# EAGLE design aux-io (EAGLE 9.2.2)

## Sheet 1 of 5
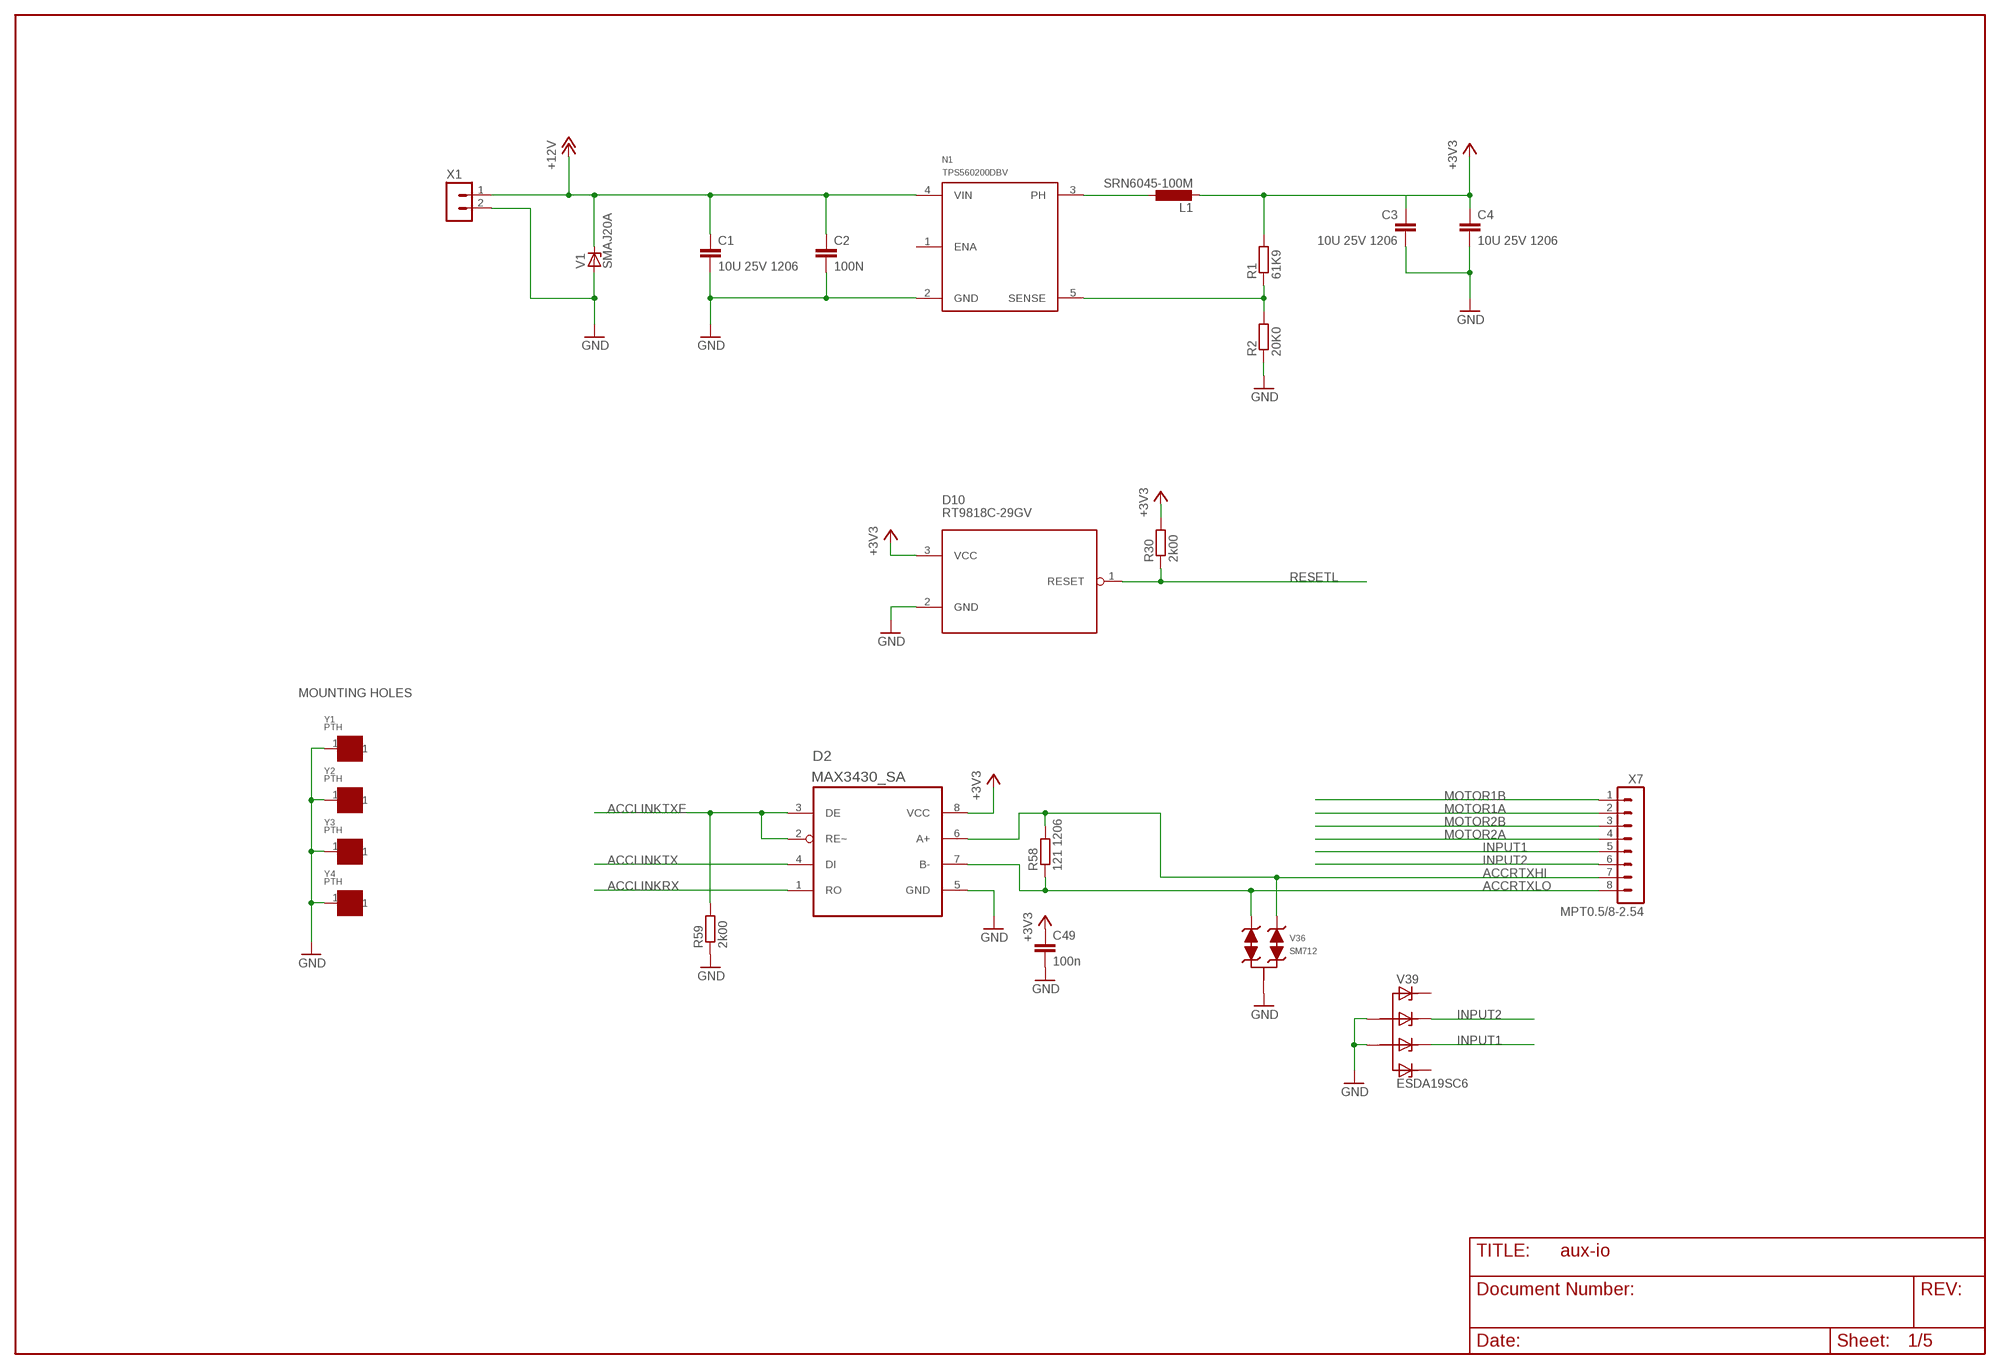
[diagram p0: schematic, sheet 1]

### Parts
C1  10U 25V 1206  CAP1206  [C1206]
C2  100N  CAP0603  [C0603]
C3  10U 25V 1206  CAP1206  [C1206]
C4  10U 25V 1206  CAP1206  [C1206]
C49  100n  CAP0603  [C0603]
D2  MAX3430_SA  MAX3088_SA  [SOIC8-N_MC]
D10  RT9818C-29GV  [SOT23]
L1  SRN6045-100M  [SRN6045]
N1  TPS560200DBV  [SOT95P280X145-5N]
R1  61K9  RES0603  [R0603]
R2  20K0  RES0603  [R0603]
R30  2k00  RES0603  [R0603]
R58  121 1206  RES1206  [R1206]
R59  2k00  RES0603  [R0603]
V1  SMAJ20A  SMAJXXA  [DO214AC]
V36  SM712  [SOT23]
V39  ESDA19SC6  ESDAXXSC6  [SOT23-6]
X1  TE_RUUVILIITIN2  [TE_RUUVILIITIN2]
X7  MPT0.5/8-2.54  [MPT0.5/8-2.54]
Y1  PTH  [PTH-3.2-6DIA]
Y2  PTH  [PTH-3.2-6DIA]
Y3  PTH  [PTH-3.2-6DIA]
Y4  PTH  [PTH-3.2-6DIA]

### Nets
+3V3: C3.1 C4.1 C49.1 D2.8(VCC) D10.3(VCC) L1.2 R1.2 R30.2 ; also sheet 4,5
+12V: C1.1 C2.1 N1.4(VIN) V1.C X1.1 ; also sheet 2,3
ACCLINKRX: D2.1(RO) ; also sheet 5
ACCLINKTX: D2.4(DI) ; also sheet 5
ACCLINKTXE: D2.2(RE~) D2.3(DE) R59.2 ; also sheet 5
ACCRTXHI: D2.6(A+) R58.2 V36.1 X7.7
ACCRTXLO: D2.7(B-) R58.1 V36.2 X7.8
GND: C1.2 C2.2 C3.2 C4.2 C49.2 D2.5(GND) D10.2(GND) N1.2(GND) R2.1 R59.1 V1.A V36.3 V39.2(A) V39.5(A1) X1.2 Y1.1 Y2.1 Y3.1 Y4.1 ; also sheet 2,3,4,5
INPUT1: V39.4(C2) X7.5 ; also sheet 5
INPUT2: V39.3(C1) X7.6 ; also sheet 5
MOTOR1A: X7.2 ; also sheet 3
MOTOR1B: X7.1 ; also sheet 3
MOTOR2A: X7.4 ; also sheet 3
MOTOR2B: X7.3 ; also sheet 3
N$1: L1.1 N1.3(PH)
N$3: N1.5(SENSE) R1.1 R2.2
RESETL: D10.1(RESET) R30.1 ; also sheet 4
Unconnected: N1.1(ENA) V39.1(C) V39.6(C3)

### Notes on the sheet
- MOUNTING HOLES

## Sheet 2 of 5
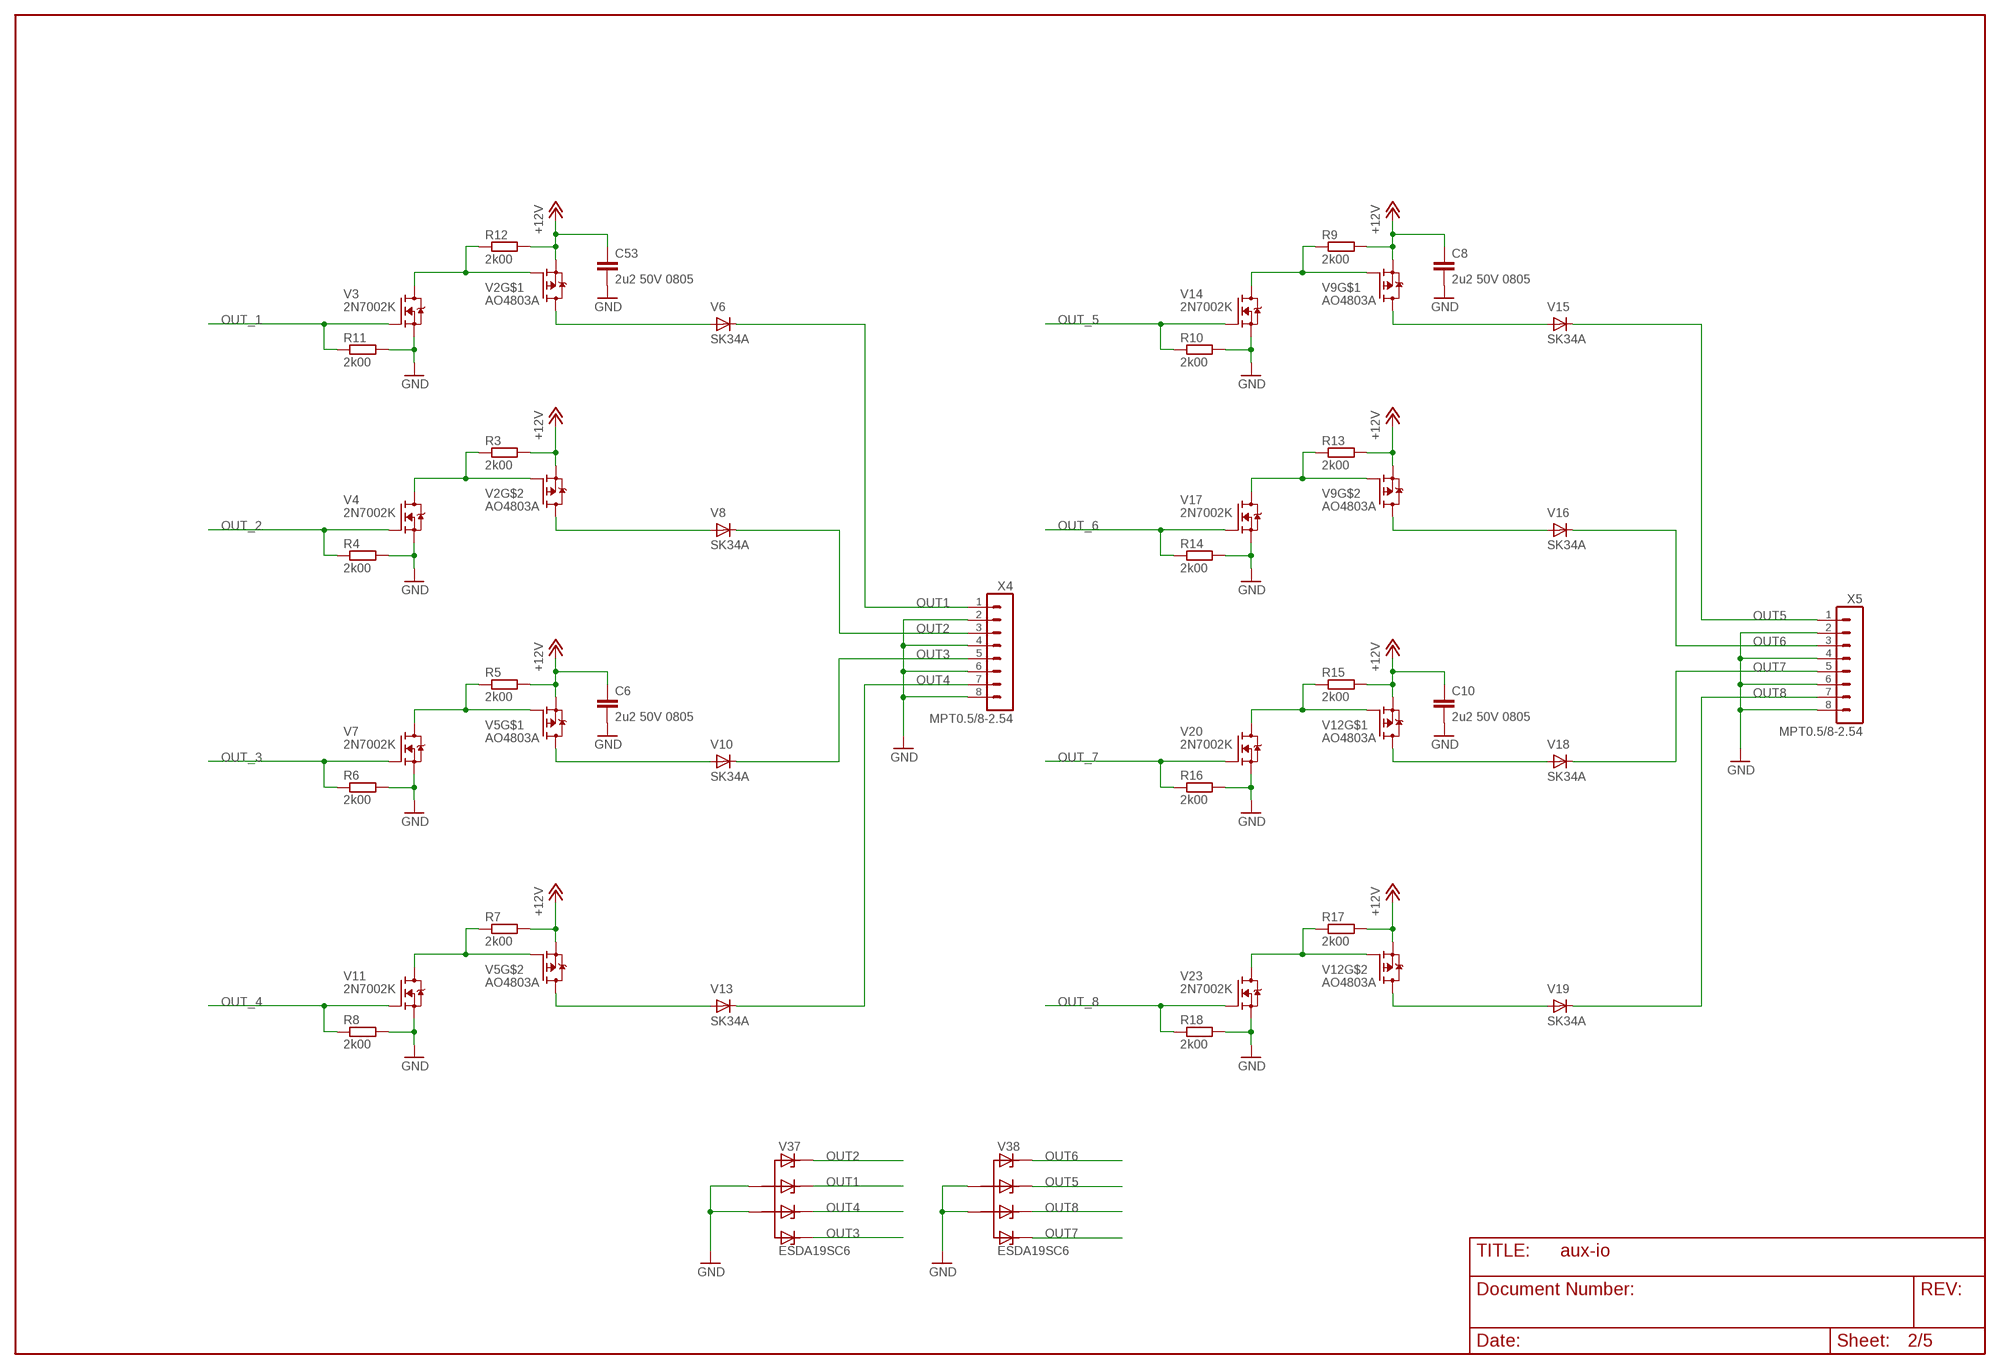
[diagram p1: schematic, sheet 2]

### Parts
C6  2u2 50V 0805  CAP0805  [C0805]
C8  2u2 50V 0805  CAP0805  [C0805]
C10  2u2 50V 0805  CAP0805  [C0805]
C53  2u2 50V 0805  CAP0805  [C0805]
R3  2k00  RES0603  [R0603]
R4  2k00  RES0603  [R0603]
R5  2k00  RES0603  [R0603]
R6  2k00  RES0603  [R0603]
R7  2k00  RES0603  [R0603]
R8  2k00  RES0603  [R0603]
R9  2k00  RES0603  [R0603]
R10  2k00  RES0603  [R0603]
R11  2k00  RES0603  [R0603]
R12  2k00  RES0603  [R0603]
R13  2k00  RES0603  [R0603]
R14  2k00  RES0603  [R0603]
R15  2k00  RES0603  [R0603]
R16  2k00  RES0603  [R0603]
R17  2k00  RES0603  [R0603]
R18  2k00  RES0603  [R0603]
V2  AO4803A  [SOIC8-N_MC]
V3  2N7002K  [SOT23]
V4  2N7002K  [SOT23]
V5  AO4803A  [SOIC8-N_MC]
V6  SK34A  [DO214AC]
V7  2N7002K  [SOT23]
V8  SK34A  [DO214AC]
V9  AO4803A  [SOIC8-N_MC]
V10  SK34A  [DO214AC]
V11  2N7002K  [SOT23]
V12  AO4803A  [SOIC8-N_MC]
V13  SK34A  [DO214AC]
V14  2N7002K  [SOT23]
V15  SK34A  [DO214AC]
V16  SK34A  [DO214AC]
V17  2N7002K  [SOT23]
V18  SK34A  [DO214AC]
V19  SK34A  [DO214AC]
V20  2N7002K  [SOT23]
V23  2N7002K  [SOT23]
V37  ESDA19SC6  ESDAXXSC6  [SOT23-6]
V38  ESDA19SC6  ESDAXXSC6  [SOT23-6]
X4  MPT0.5/8-2.54  [MPT0.5/8-2.54]
X5  MPT0.5/8-2.54  [MPT0.5/8-2.54]

### Nets
+12V: C6.1 C8.1 C10.1 C53.1 R3.2 R5.2 R7.2 R9.2 R12.2 R13.2 R15.2 R17.2 V2.1(S) V2.3(S) V5.1(S) V5.3(S) V9.1(S) V9.3(S) V12.1(S) V12.3(S) ; also sheet 1,3
GND: C6.2 C8.2 C10.2 C53.2 R4.2 R6.2 R8.2 R10.2 R11.2 R14.2 R16.2 R18.2 V3.2(S) V4.2(S) V7.2(S) V11.2(S) V14.2(S) V17.2(S) V20.2(S) V23.2(S) V37.2(A) V37.5(A1) V38.2(A) V38.5(A1) X4.2 X4.4 X4.6 X4.8 X5.2 X5.4 X5.6 X5.8 ; also sheet 1,3,4,5
N$2: R3.1 V2.2(G) V4.3(D)
N$4: R5.1 V5.4(G) V7.3(D)
N$5: R7.1 V5.2(G) V11.3(D)
N$6: R9.1 V9.4(G) V14.3(D)
N$7: R13.1 V9.2(G) V17.3(D)
N$8: R15.1 V12.4(G) V20.3(D)
N$9: R17.1 V12.2(G) V23.3(D)
N$11: R12.1 V2.4(G) V3.3(D)
NERT: V2.5(D) V2.6(D) V6.A
NERT1: V2.7(D) V2.8(D) V8.A
NERT2: V5.5(D) V5.6(D) V10.A
NERT3: V5.7(D) V5.8(D) V13.A
NERT4: V9.5(D) V9.6(D) V15.A
NERT5: V9.7(D) V9.8(D) V16.A
NERT6: V12.5(D) V12.6(D) V18.A
NERT7: V12.7(D) V12.8(D) V19.A
OUT1: V6.C V37.3(C1) X4.1
OUT2: V8.C V37.1(C) X4.3
OUT3: V10.C V37.6(C3) X4.5
OUT4: V13.C V37.4(C2) X4.7
OUT5: V15.C V38.3(C1) X5.1
OUT6: V16.C V38.1(C) X5.3
OUT7: V18.C V38.6(C3) X5.5
OUT8: V19.C V38.4(C2) X5.7
OUT_1: R11.1 V3.1(G) ; also sheet 5
OUT_2: R4.1 V4.1(G) ; also sheet 5
OUT_3: R6.1 V7.1(G) ; also sheet 5
OUT_4: R8.1 V11.1(G) ; also sheet 5
OUT_5: R10.1 V14.1(G) ; also sheet 5
OUT_6: R14.1 V17.1(G) ; also sheet 5
OUT_7: R16.1 V20.1(G) ; also sheet 5
OUT_8: R18.1 V23.1(G) ; also sheet 5

## Sheet 3 of 5
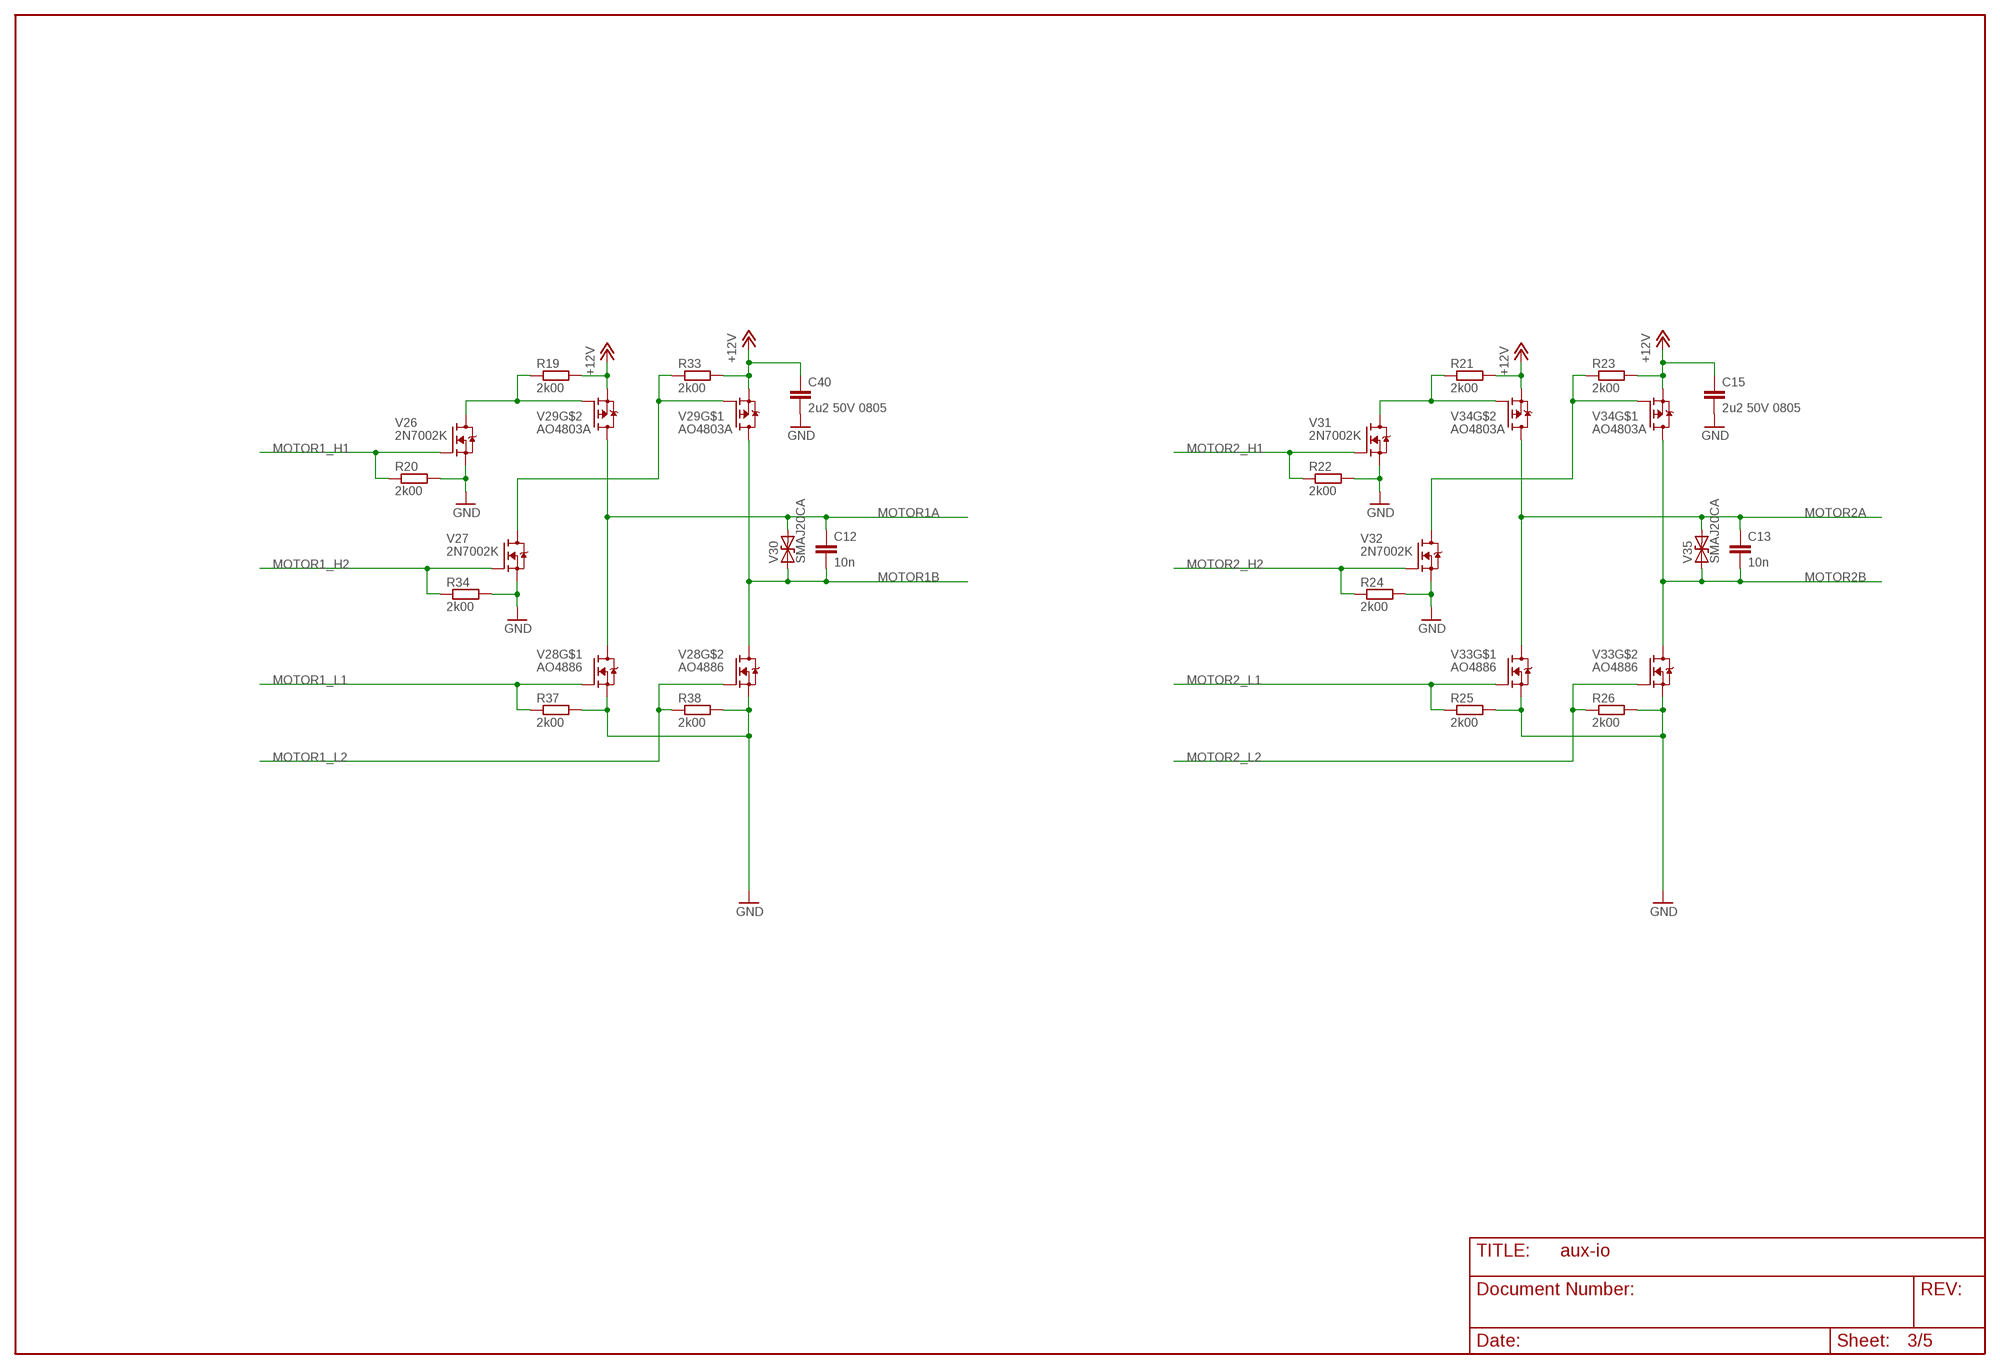
[diagram p2: schematic, sheet 3]

### Parts
C12  10n  CAP0603  [C0603]
C13  10n  CAP0603  [C0603]
C15  2u2 50V 0805  CAP0805  [C0805]
C40  2u2 50V 0805  CAP0805  [C0805]
R19  2k00  RES0603  [R0603]
R20  2k00  RES0603  [R0603]
R21  2k00  RES0603  [R0603]
R22  2k00  RES0603  [R0603]
R23  2k00  RES0603  [R0603]
R24  2k00  RES0603  [R0603]
R25  2k00  RES0603  [R0603]
R26  2k00  RES0603  [R0603]
R33  2k00  RES0603  [R0603]
R34  2k00  RES0603  [R0603]
R37  2k00  RES0603  [R0603]
R38  2k00  RES0603  [R0603]
V26  2N7002K  [SOT23]
V27  2N7002K  [SOT23]
V28  AO4886  [SOIC8-N_MC]
V29  AO4803A  [SOIC8-N_MC]
V30  SMAJ20CA  SMAJXXCA  [DO214AC]
V31  2N7002K  [SOT23]
V32  2N7002K  [SOT23]
V33  AO4886  [SOIC8-N_MC]
V34  AO4803A  [SOIC8-N_MC]
V35  SMAJ20CA  SMAJXXCA  [DO214AC]

### Nets
+12V: C15.1 C40.1 R19.2 R21.2 R23.2 R33.2 V29.1(S) V29.3(S) V34.1(S) V34.3(S) ; also sheet 1,2
GND: C15.2 C40.2 R20.2 R22.2 R24.2 R25.2 R26.2 R34.2 R37.2 R38.2 V26.2(S) V27.2(S) V28.1(S) V28.3(S) V31.2(S) V32.2(S) V33.1(S) V33.3(S) ; also sheet 1,2,4,5
MOTOR1_H1: R20.1 V26.1(G) ; also sheet 5
MOTOR1_H2: R34.1 V27.1(G) ; also sheet 5
MOTOR1_L1: R37.1 V28.4(G) ; also sheet 5
MOTOR1_L2: R38.1 V28.2(G) ; also sheet 5
MOTOR1A: C12.1 V28.5(D) V28.6(D) V29.7(D) V29.8(D) V30.A ; also sheet 1
MOTOR1B: C12.2 V28.7(D) V28.8(D) V29.5(D) V29.6(D) V30.C ; also sheet 1
MOTOR2_H1: R22.1 V31.1(G) ; also sheet 5
MOTOR2_H2: R24.1 V32.1(G) ; also sheet 5
MOTOR2_L1: R25.1 V33.4(G) ; also sheet 5
MOTOR2_L2: R26.1 V33.2(G) ; also sheet 5
MOTOR2A: C13.1 V33.5(D) V33.6(D) V34.7(D) V34.8(D) V35.A ; also sheet 1
MOTOR2B: C13.2 V33.7(D) V33.8(D) V34.5(D) V34.6(D) V35.C ; also sheet 1
N$10: R19.1 V26.3(D) V29.2(G)
N$12: R33.1 V27.3(D) V29.4(G)
N$15: R21.1 V31.3(D) V34.2(G)
N$16: R23.1 V32.3(D) V34.4(G)

## Sheet 4 of 5
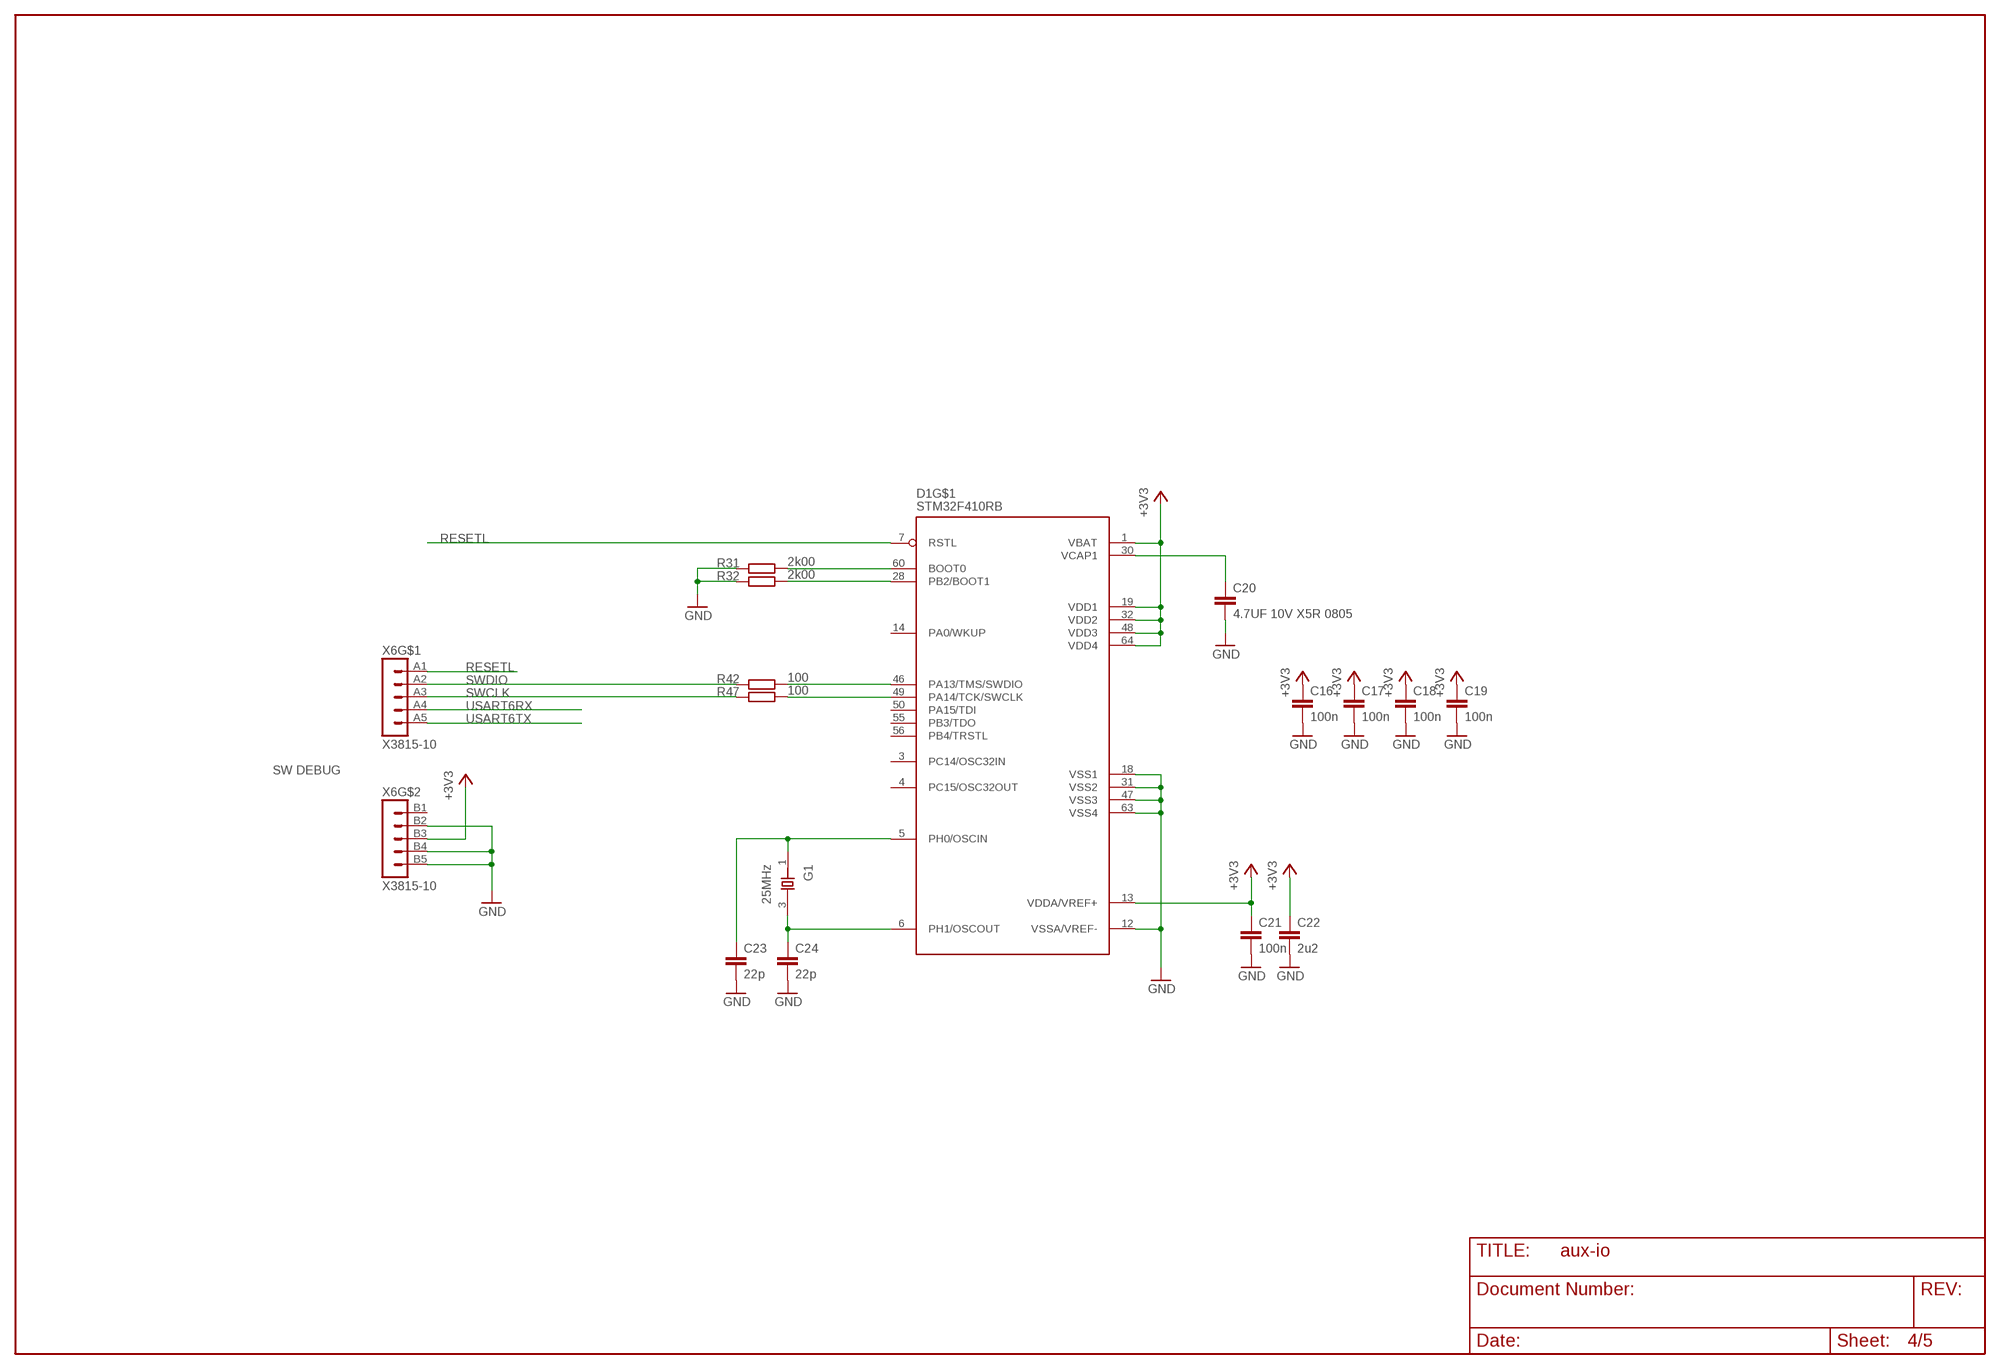
[diagram p3: schematic, sheet 4]

### Parts
C16  100n  CAP0603  [C0603]
C17  100n  CAP0603  [C0603]
C18  100n  CAP0603  [C0603]
C19  100n  CAP0603  [C0603]
C20  4.7UF 10V X5R 0805  CAP0805  [C0805]
C21  100n  CAP0603  [C0603]
C22  2u2  CAP0603  [C0603]
C23  22p  CAP0603  [C0603]
C24  22p  CAP0603  [C0603]
D1  STM32F410RB  [LQFP-64]
G1  25MHz  XTAL_3225_SMD  [X_3225]
R31  2k00  RES0603  [R0603]
R32  2k00  RES0603  [R0603]
R42  100  RES0603  [R0603]
R47  100  RES0603  [R0603]
X6  X3815-10  [15110102601]

### Nets
+3V3: C16.1 C17.1 C18.1 C19.1 C21.1 C22.1 D1.1(VBAT) D1.13(VDDA/VREF+) D1.19(VDD1) D1.32(VDD2) D1.48(VDD3) D1.64(VDD4) X6.B3 ; also sheet 1,5
BOOT0: D1.60(BOOT0) R31.2
BOOT1: D1.28(PB2/BOOT1) R32.2
GND: C16.2 C17.2 C18.2 C19.2 C20.2 C21.2 C22.2 C23.2 C24.2 D1.12(VSSA/VREF-) D1.18(VSS1) D1.31(VSS2) D1.47(VSS3) D1.63(VSS4) R31.1 R32.1 X6.B2 X6.B4 X6.B5 ; also sheet 1,2,3,5
OSCIN: C23.1 D1.5(PH0/OSCIN) G1.1(X1)
OSCOUT: C24.1 D1.6(PH1/OSCOUT) G1.3(X2)
RESETL: D1.7(RSTL) X6.A1 ; also sheet 1
SWCLK: R47.1 X6.A3
SWCLK_CPU: D1.49(PA14/TCK/SWCLK) R47.2
SWDIO: R42.1 X6.A2
SWDIO_CPU: D1.46(PA13/TMS/SWDIO) R42.2
USART6RX: X6.A4 ; also sheet 5
USART6TX: X6.A5 ; also sheet 5
VCAP1: C20.1 D1.30(VCAP1)
Unconnected: D1.3(PC14/OSC32IN) D1.4(PC15/OSC32OUT) D1.14(PA0/WKUP) D1.50(PA15/TDI) D1.55(PB3/TDO) D1.56(PB4/TRSTL) X6.B1

### Notes on the sheet
- SW DEBUG

## Sheet 5 of 5
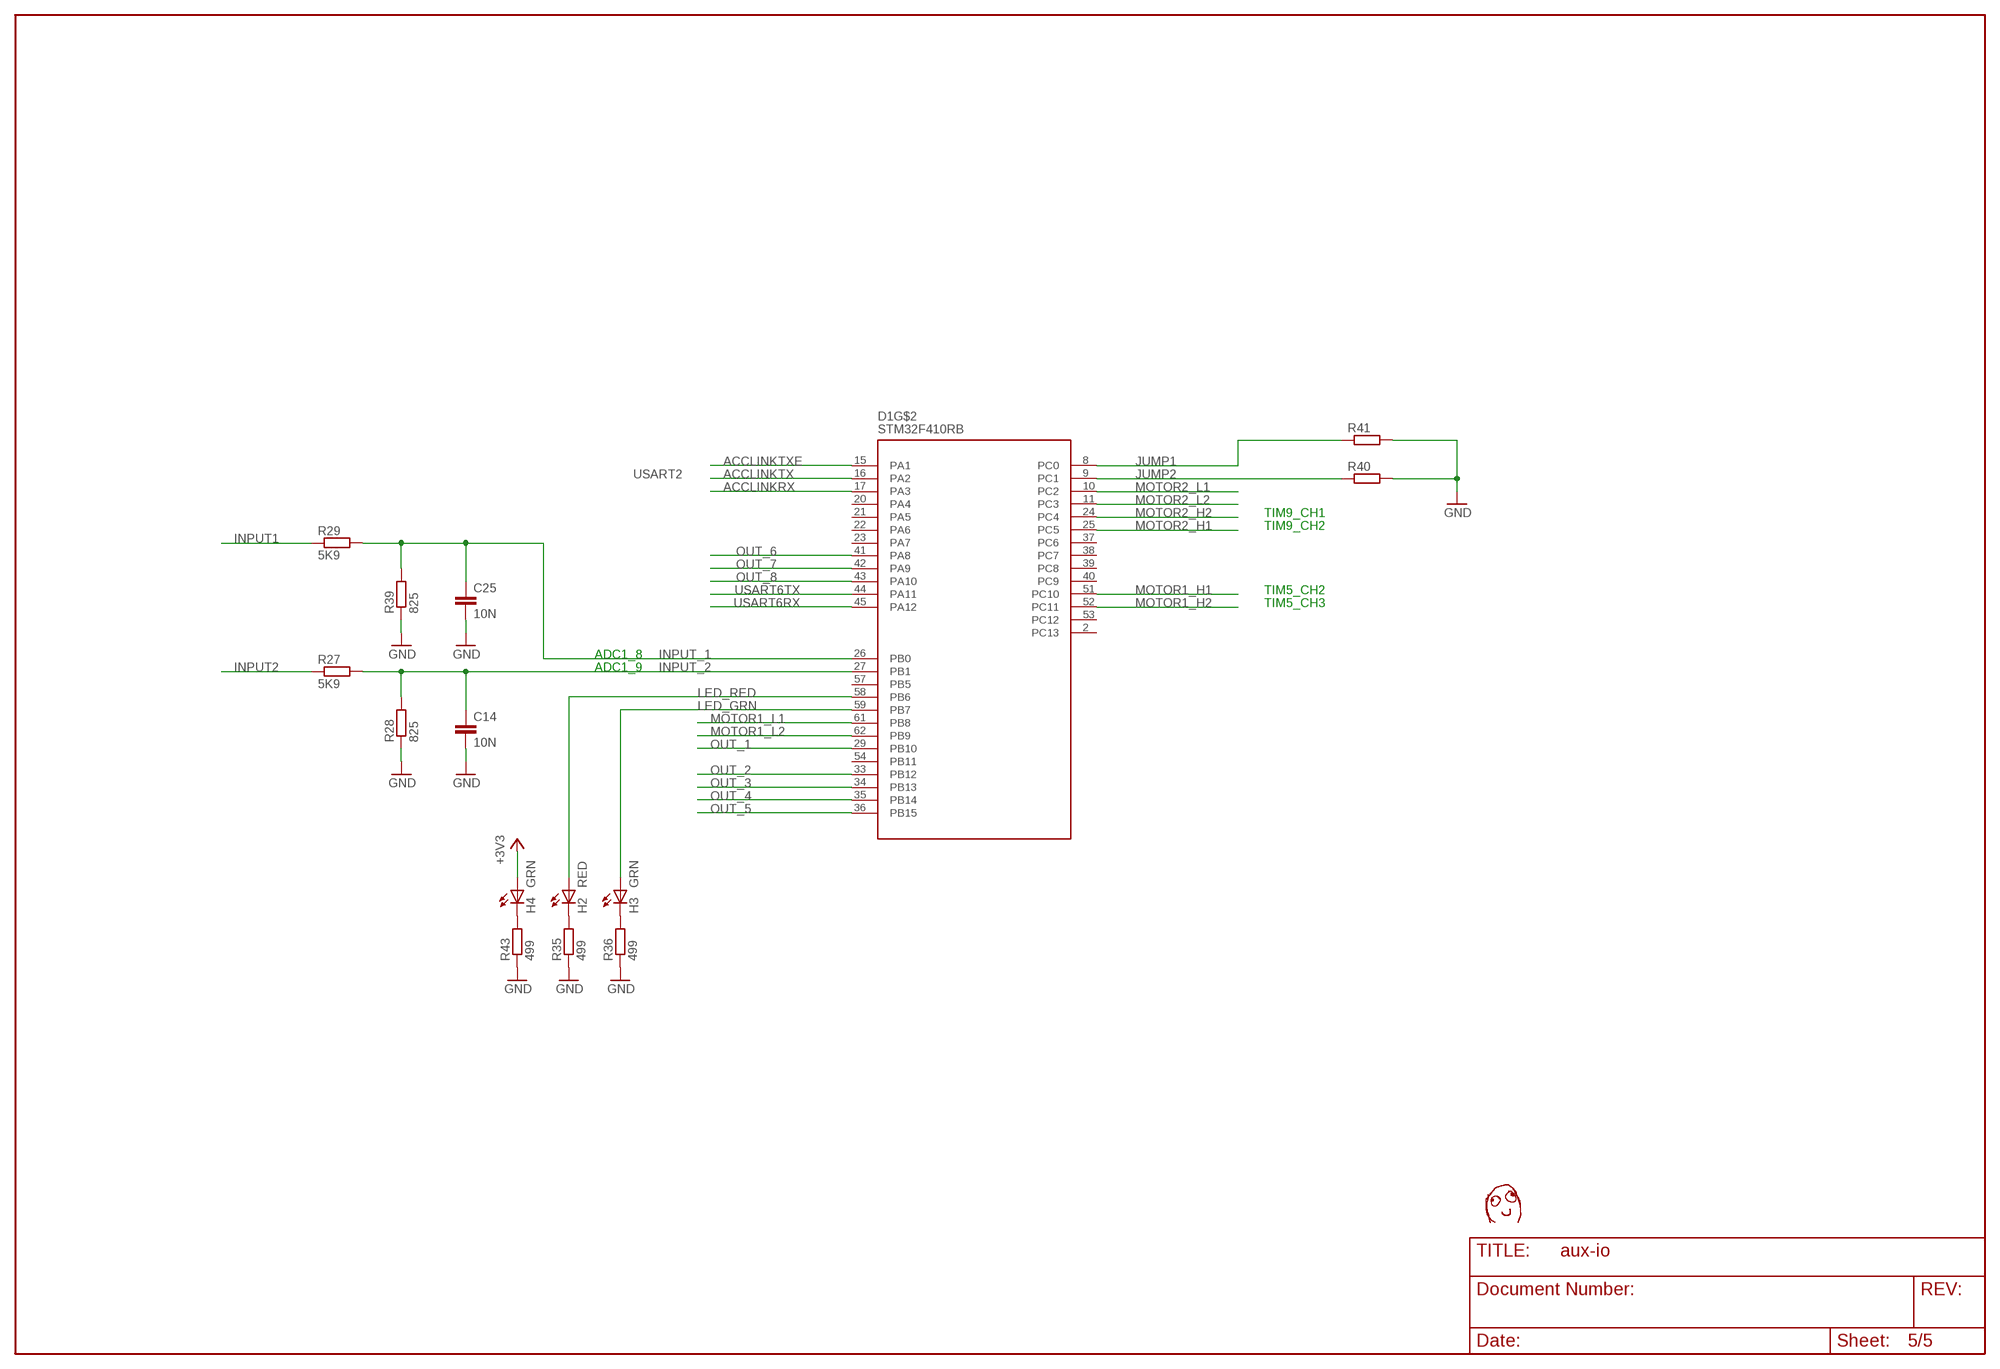
[diagram p4: schematic, sheet 5]

### Parts
C14  10N  CAP0603  [C0603]
C25  10N  CAP0603  [C0603]
H2  RED  LEDCHIP-LED0603  [CHIP-LED0603]
H3  GRN  LEDCHIP-LED0603  [CHIP-LED0603]
H4  GRN  LEDCHIP-LED0603  [CHIP-LED0603]
R27  5K9  RES1206  [R1206]
R28  825  RES0603  [R0603]
R29  5K9  RES1206  [R1206]
R35  499  RES0603  [R0603]
R36  499  RES0603  [R0603]
R39  825  RES0603  [R0603]
R40  RES0603  [R0603]
R41  RES0603  [R0603]
R43  499  RES0603  [R0603]
U$1  DAFUG  [DAFUG]

### Nets
+3V3: H4.A ; also sheet 1,4
ACCLINKRX: D1.17(PA3) ; also sheet 1
ACCLINKTX: D1.16(PA2) ; also sheet 1
ACCLINKTXE: D1.15(PA1) ; also sheet 1
GND: C14.2 C25.2 R28.1 R35.1 R36.1 R39.1 R40.2 R41.2 R43.1 ; also sheet 1,2,3,4
INPUT1: R29.1 ; also sheet 1
INPUT2: R27.1 ; also sheet 1
INPUT_1: C25.1 D1.26(PB0) R29.2 R39.2
INPUT_2: C14.1 D1.27(PB1) R27.2 R28.2
JUMP1: D1.8(PC0) R41.1
JUMP2: D1.9(PC1) R40.1
LED_GRN: D1.59(PB7) H3.A
LED_RED: D1.58(PB6) H2.A
MOTOR1_H1: D1.51(PC10) ; also sheet 3
MOTOR1_H2: D1.52(PC11) ; also sheet 3
MOTOR1_L1: D1.61(PB8) ; also sheet 3
MOTOR1_L2: D1.62(PB9) ; also sheet 3
MOTOR2_H1: D1.25(PC5) ; also sheet 3
MOTOR2_H2: D1.24(PC4) ; also sheet 3
MOTOR2_L1: D1.10(PC2) ; also sheet 3
MOTOR2_L2: D1.11(PC3) ; also sheet 3
N$19: H3.C R36.2
N$20: H2.C R35.2
N$21: H4.C R43.2
OUT_1: D1.29(PB10) ; also sheet 2
OUT_2: D1.33(PB12) ; also sheet 2
OUT_3: D1.34(PB13) ; also sheet 2
OUT_4: D1.35(PB14) ; also sheet 2
OUT_5: D1.36(PB15) ; also sheet 2
OUT_6: D1.41(PA8) ; also sheet 2
OUT_7: D1.42(PA9) ; also sheet 2
OUT_8: D1.43(PA10) ; also sheet 2
USART6RX: D1.45(PA12) ; also sheet 4
USART6TX: D1.44(PA11) ; also sheet 4
Unconnected: D1.2(PC13) D1.20(PA4) D1.21(PA5) D1.22(PA6) D1.23(PA7) D1.37(PC6) D1.38(PC7) D1.39(PC8) D1.40(PC9) D1.53(PC12) D1.54(PB11) D1.57(PB5)

### Notes on the sheet
- USART2
- TIM9_CH1
- TIM9_CH2
- TIM5_CH2
- TIM5_CH3
- ADC1_8
- ADC1_9

## Library data of the parts
C1-C4 C14 C25 = passiivit:CAP
C6 C8 C10 C12 C13 C15-C24 C40 C49 C53 = omat_ic_2:CAP
D1 = piirit:STM32F410RB
D2 = omat_ic_2:MAX3088_SA
D10 = omat_ic_2:RT9818C-29GV
G1 = omat_ic_2:XTAL_3225_SMD: CRYSTAL CLOCK OSCILLATORS 5.0 Vdc or 3.3 Vdc - LOW PROFILE ULTRA MINIATURE CERAMIC SURFACE MOUNT Source: http://www.abracon.com/Oscillators/asf1-L-L1.pdf
H2-H4 = omat_ic_2:LED: LED OSRAM: - CHIPLED LG R971, LG N971, LY N971, LG Q971, LY Q971, LO R971, LY R971 LH N974, LH R974 LS Q976, LO Q976, LY Q976 LO Q996 - Hyper CHIPLED LW Q18S LB Q993, LB Q99A, LB R99A - SideLED LS A670, LO A670, LY A670, LG A670, LP A670 LB A673, LV A673, LT A673, LW A673 LH A674 LY A675 LS A676, LA A676, LO A676, LY A676, LW A676 LS A679, LY A679, LG A679 - Hyper Micro SIDELED® LS Y876, LA Y876, LO Y876, LY Y876 LT Y87S - SmartLED LW L88C, LW L88S LB L89C, LB L89S, LG L890 LS L89K, LO L89K, LY L89K LS L896, LA L896, LO L896, LY L896 - TOPLED LS T670, LO T670, LY T670, LG T670, LP T670 LSG T670, LSP T670, LSY T670, LOP T670, LYG T670 LG T671, LOG T671, LSG T671 LB T673, LV T673, LT T673, LW T673 LH T674 LS T676, LA T676, LO T676, LY T676, LB T676, LH T676, LSB T676, LW T676 LB T67C, LV T67C, LT T67C, LS T67K, LO T67K, LY T67K, LW E67C LS E67B, LA E67B, LO E67B, LY E67B, LB E67C, LV E67C, LT E67C LW T67C LS T679, LY T679, LG T679 LS T770, LO T770, LY T770, LG T770, LP T770 LB T773, LV T773, LT T773, LW T773 LH T774 LS E675, LA E675, LY E675, LS T675 LS T776, LA T776, LO T776, LY T776, LB T776 LHGB T686 LT T68C, LB T68C - Hyper Mini TOPLED® LB M676 - Mini TOPLED Santana® LG M470 LS M47K, LO M47K, LY M47K Source: http://www.osram.convergy.de LUXEON: - LUMILED® LXK2-PW12-R00, LXK2-PW12-S00, LXK2-PW14-U00, LXK2-PW14-V00 LXK2-PM12-R00, LXK2-PM12-S00, LXK2-PM14-U00 LXK2-PE12-Q00, LXK2-PE12-R00, LXK2-PE12-S00, LXK2-PE14-T00, LXK2-PE14-U00 LXK2-PB12-K00, LXK2-PB12-L00, LXK2-PB12-M00, LXK2-PB14-N00, LXK2-PB14-P00, LXK2-PB14-Q00 LXK2-PR12-L00, LXK2-PR12-M00, LXK2-PR14-Q00, LXK2-PR14-R00 LXK2-PD12-Q00, LXK2-PD12-R00, LXK2-PD12-S00 LXK2-PH12-R00, LXK2-PH12-S00 LXK2-PL12-P00, LXK2-PL12-Q00, LXK2-PL12-R00 Source: www.luxeon.com KINGBRIGHT: KA-3528ASYC Source: www.kingbright.com
L1 = passiivit:SRN6045
N1 = piirit:TPS560200DBV
R1 R2 R27-R29 R39-R41 = passiivit:RES
R3-R26 R30-R38 R42 R43 R47 R58 R59 = omat_ic_2:RES
U$1 = omat:DAFUG
V1 = diskreetit:SMAJXXA
V2 V5 V9 V12 = diskreetit:AO4803A
V3 V4 V7 V11 V14 V17 V20 V23 V26 V27 V31 V32 = omat_ic_2:2N7002K
V6 V8 V10 V13 V15 V16 V18 V19 = diskreetit:SK34A
V28 V33 = omat_ic_2:AO4886
V29 V34 = omat_ic_2:AO4803A
V30 V35 = omat_ic_2:SMAJXXCA
V36 = omat_ic_2:SM712
V37-V39 = diskreetit:ESDAXXSC6
X1 = liittimet:TE_RUUVILIITIN2
X4 X5 X7 = liittimet:MPT0.5/8-2.54
X6 = liittimet:X3815-10
Y1-Y4 = omat:PTH

## Net classes
2 other: width 0.3 mm, drill 0.3 mm, clearance 1 mm to class 1
3 supply: width 0.3 mm, drill 0.3 mm
4 power: width 0.5 mm, drill 0.5 mm

## Board
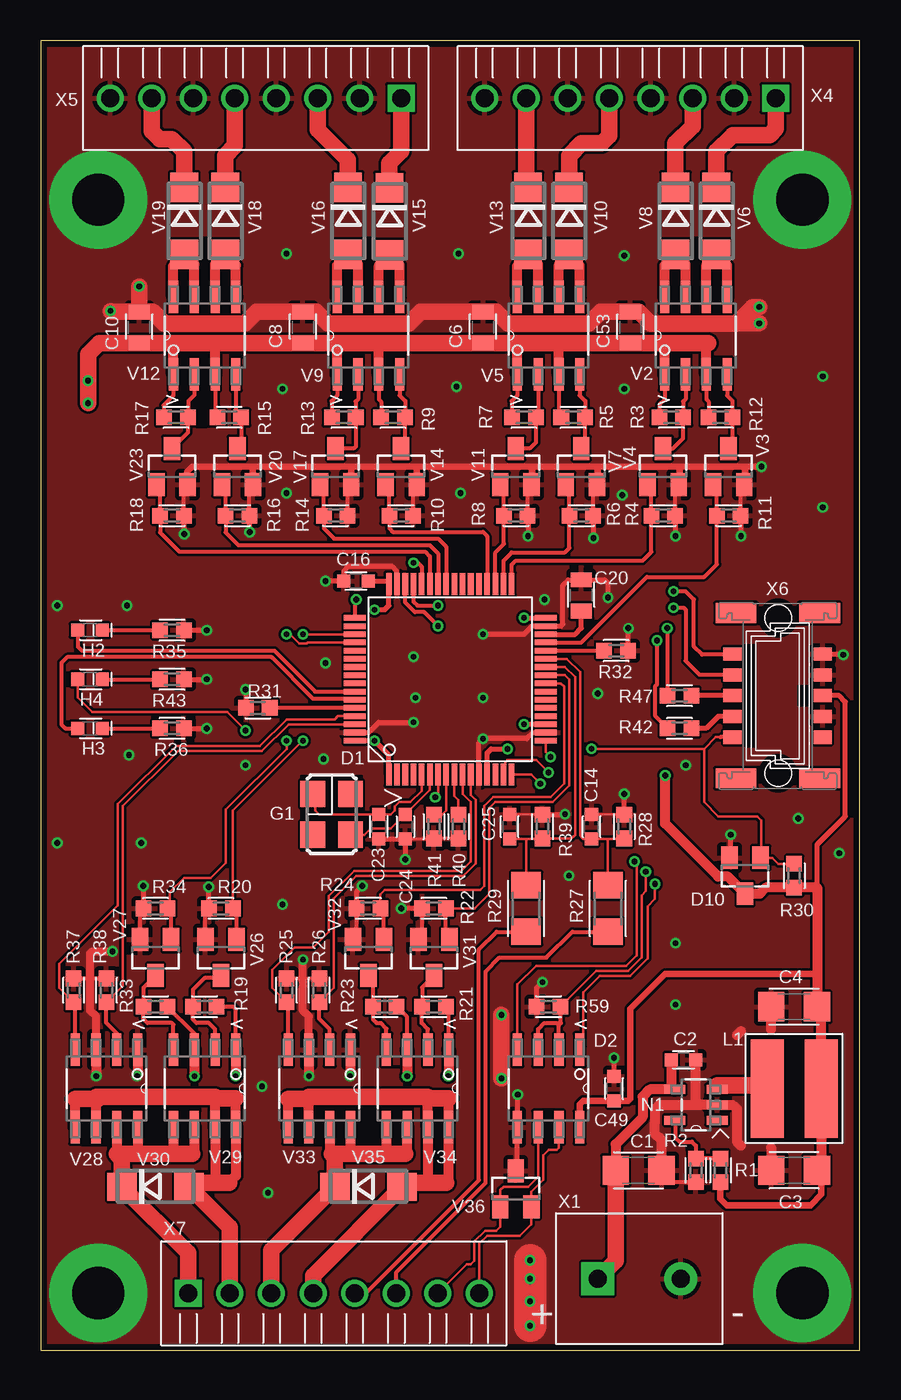
[diagram p5: board, top side]
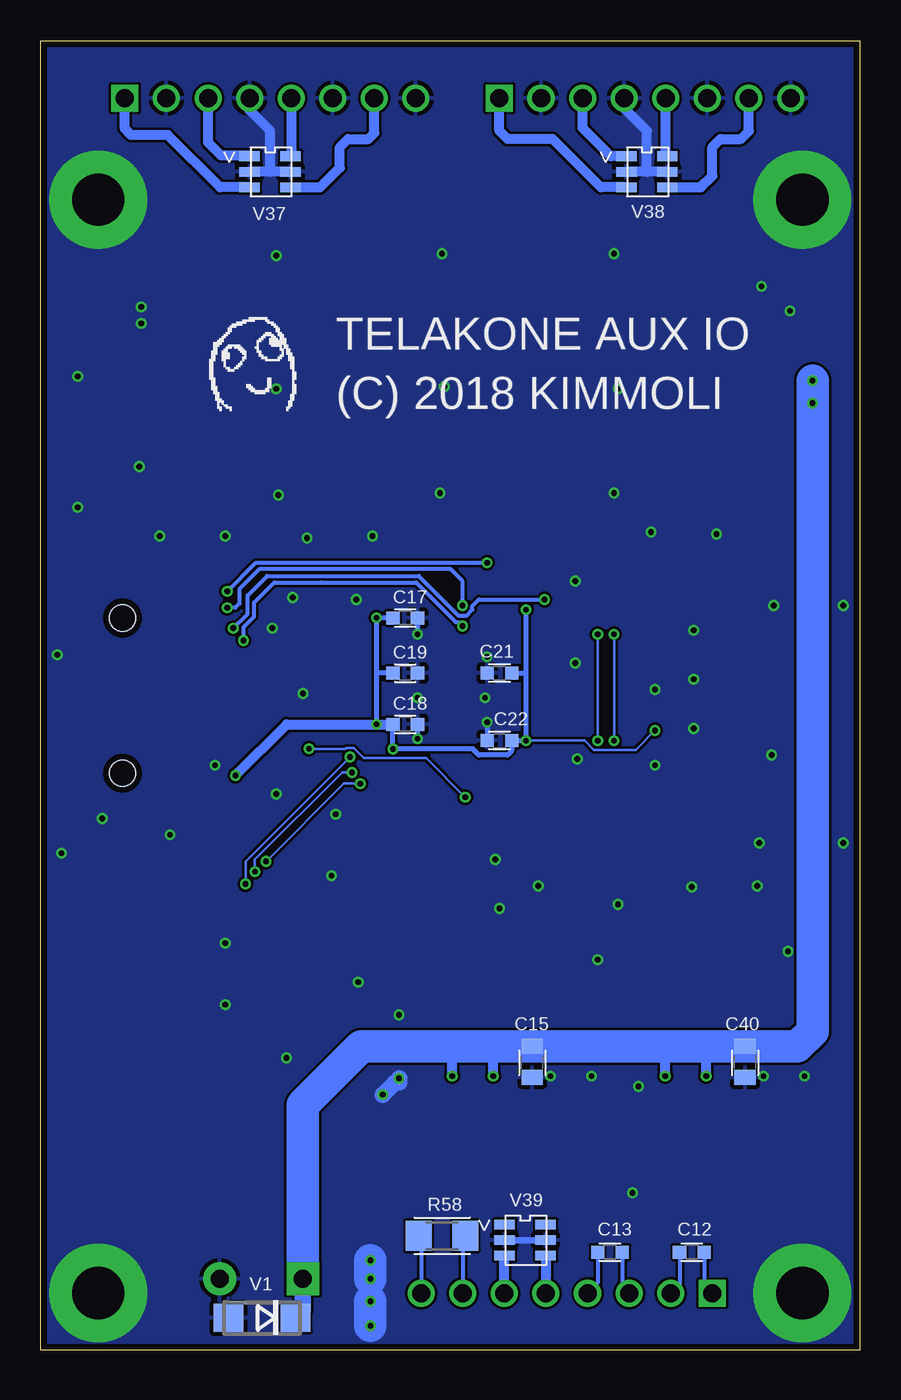
[diagram p6: board, bottom side, seen from below]

Size 50 x 80 mm. Coordinates in mm from the lower left corner, seen from the top.
Outline: 0,0 50,0 50,80 0,80 0,0
Copper layers (1*16): Top 0.035mm / dielectric 1.5mm / Bottom 0.035mm
Design rules "ITeadstudio *": minimum track width 6mil, minimum drill 12mil, track to track 6mil, track to pad 6mil, pad to pad 6mil, via to via 6mil, smd to smd 0mil, copper to edge 15mil, drill to drill 10mil, minimum pad ring 10mil, minimum via ring 6mil, stop-mask expansion 2mil, vias tented up to drill 100mil, thermal gap 10mil
tRestrict: area 15.5,12.5 to 17.1,12.6; area 2.5,12.5 to 4.1,12.6; area 8.4,17.2 to 8.9,17.4; area 21.4,17.2 to 21.9,17.4; area 9.5,56.4 to 10.1,56.5; area 18.5,63.2 to 21.5,63.4; area 19.6,67.9 to 20.4,68; area 8.5,63.2 to 11.5,63.4; area 9.8,67.9 to 10.2,68; area 29.5,63.2 to 32.5,63.4; area 30.8,67.9 to 31.2,68; area 39.8,67.9 to 40.2,68; area 38.5,63.2 to 41.5,63.4; area 41.1,60.6 to 41.5,60.8; area 42.9,36.9 to 43.6,43.1; area 46.2,39.4 to 47,40.6; area 43,12.6 to 49,19.4; area 15.9,30.5 to 19.6,35.1; area 30.8,14.6 to 31.2,14.8

### Footprints (pad centres in the part's own frame; a part is rotated, then mirrored left to right if it is on the bottom)
C1206 = smd 1.6 x 1.8: 1 -1.4,0; 2 1.4,0
C0603 = smd 0.8 x 0.8: 1 -0.75,0; 2 0.75,0
C0805 = smd 0.9 x 1.3: 1 -0.95,0; 2 0.95,0
LQFP-64 = smd 0.34 x 1.35: 1 -3.75,-5.825; 2 -3.25,-5.825; 3 -2.75,-5.825; 4 -2.25,-5.825; 5 -1.75,-5.825; 6 -1.25,-5.825; 7 -0.75,-5.825; 8 -0.25,-5.825; 9 0.25,-5.825; 10 0.75,-5.825; 11 1.25,-5.825; 12 1.75,-5.825; 13 2.25,-5.825; 14 2.75,-5.825; 15 3.25,-5.825; 16 3.75,-5.825; 33 3.75,5.825; 34 3.25,5.825; 35 2.75,5.825; 36 2.25,5.825; 37 1.75,5.825; 38 1.25,5.825; 39 0.75,5.825; 40 0.25,5.825; 41 -0.25,5.825; 42 -0.75,5.825; 43 -1.25,5.825; 44 -1.75,5.825; 45 -2.25,5.825; 46 -2.75,5.825; 47 -3.25,5.825; 48 -3.75,5.825 | smd 1.35 x 0.34: 17 5.825,-3.75; 18 5.825,-3.25; 19 5.825,-2.75; 20 5.825,-2.25; 21 5.825,-1.75; 22 5.825,-1.25; 23 5.825,-0.75; 24 5.825,-0.25; 25 5.825,0.25; 26 5.825,0.75; 27 5.825,1.25; 28 5.825,1.75; 29 5.825,2.25; 30 5.825,2.75; 31 5.825,3.25; 32 5.825,3.75; 49 -5.825,3.75; 50 -5.825,3.25; 51 -5.825,2.75; 52 -5.825,2.25; 53 -5.825,1.75; 54 -5.825,1.25; 55 -5.825,0.75; 56 -5.825,0.25; 57 -5.825,-0.25; 58 -5.825,-0.75; 59 -5.825,-1.25; 60 -5.825,-1.75; 61 -5.825,-2.25; 62 -5.825,-2.75; 63 -5.825,-3.25; 64 -5.825,-3.75
SOIC8-N_MC = smd 1.981 x 0.559: 1 -2.362,1.905; 2 -2.362,0.635; 3 -2.362,-0.635; 4 -2.362,-1.905; 5 2.362,-1.905; 6 2.362,-0.635; 7 2.362,0.635; 8 2.362,1.905
SOT23 = smd 1 x 1.4: 1 -0.95,-1.1; 2 0.95,-1.1; 3 0,1.1
X_3225 = smd 1.6 x 1.5: 1 -1.25,-1.15; 2 1.25,-1.15; 3 1.25,1.15; 4 -1.25,1.15
CHIP-LED0603 = smd 0.8 x 0.8: A -0.75,0; C 0.75,0
SRN6045 = smd 2 x 6: 1 -1.65,0; 2 1.65,0
SOT95P280X145-5N = smd 1.27 x 0.559: 1 -1.295,0.94; 2 -1.295,0; 3 -1.295,-0.94; 4 1.295,-0.94; 5 1.295,0.94
R0603 = smd 0.95 x 0.95: 1 -0.725,0; 2 0.725,0
R1206 = smd 1.6 x 1.803: 1 -1.422,0; 2 1.422,0
DO214AC = smd 1.8 x 1.7: A 2.05,0; C -2.05,0
SOT23-6 = smd 1.25 x 0.6: 1 -1.25,0.95; 2 -1.25,0; 3 -1.25,-0.95; 4 1.25,-0.95; 5 1.25,0; 6 1.25,0.95
TE_RUUVILIITIN2 = drill 1.1 pad 2 square: 1 0,0 | drill 1.1 pad 2: 2 5.08,0
MPT0.5/8-2.54 = drill 1.1 square: 1 0,0 | drill 1.1: 2 2.54,0; 3 5.08,0; 4 7.62,0; 5 10.16,0; 6 12.7,0; 7 15.24,0; 8 17.78,0
15110102601 = smd 0.8 x 1.1: A1 -2.54,2.765; A2 -1.27,2.765; A3 0,2.765; A4 1.27,2.765; A5 2.54,2.765; B1 -2.54,-2.74; B2 -1.27,-2.74; B3 0,-2.74; B4 1.27,-2.74; B5 2.54,-2.74 | smd 1.2 x 2.5: M1 -5.045,2.55; M2 -5.045,-2.55; M3 5.045,-2.55; M4 5.045,2.55 | hole 1.6: -4.738,-0.022; 4.738,-0.022
PTH-3.2-6DIA = drill 3.2 pad 6: 1 0,0

### Placement (x,y rotation side)
C1  36.5,11 0 top
C2  39.25,17.75 0 top
C3  46,11 180 top
C4  46,21 180 top
C6  27,62.5 90 top
C8  16,62.5 90 top
C10  6,62.5 90 top
C12  10.25,6 0 bottom
C13  15.25,6 0 bottom
C14  33.62,32 90 top
C15  20,17.62 270 bottom
C16  19.25,47 180 top
C17  27.75,44.75 0 bottom
C18  27.75,38.25 0 bottom
C19  27.75,41.38 0 bottom
C20  33,46.12 90 top
C21  22,41.38 180 bottom
C22  22,37.25 180 bottom
C23  20.62,32 270 top
C24  22.25,32 270 top
C25  28.62,32 90 top
C40  7,17.62 270 bottom
C49  35,16 90 top
C53  36,62.5 90 top
D1  25,41 0 top
D2  31,16 270 top
D10  43,29 180 top
DRILEGEND  [DRILEGEND]  -0.15,-4.07 0 top  (outside the outline)
G1  17.75,32.75 270 top
H2  3,44 0 top
H3  3,38 0 top
H4  3,41 0 top
L1  46,16 0 top
N1  40,15 180 top
R1  41.5,11 270 top
R2  40,11 90 top
R3  38.5,57 180 top
R4  38,51 0 top
R5  32.5,57 180 top
R6  33,51 0 top
R7  29.5,57 180 top
R8  29,51 0 top
R9  21.5,57 180 top
R10  22,51 0 top
R11  42,51 0 top
R12  41.5,57 180 top
R13  18.5,57 180 top
R14  18,51 0 top
R15  11.5,57 180 top
R16  12,51 0 top
R17  8.25,57 180 top
R18  8,51 0 top
R19  10,21 0 top
R20  11,27 180 top
R21  24,21 0 top
R22  24,27 180 top
R23  21,21 0 top
R24  20,27 180 top
R25  15,22 90 top
R26  17,22 90 top
R27  34.62,27 90 top
R28  35.62,32 270 top
R29  29.62,27 90 top
R30  46,29 270 top
R31  13.25,39.25 0 top
R32  35.12,42.75 180 top
R33  7,21 0 top
R34  7,27 180 top
R35  8,44 180 top
R36  8,38 180 top
R37  2,22 90 top
R38  4,22 90 top
R39  30.62,32 270 top
R40  25.5,32 270 top
R41  24,32 270 top
R42  39,38 180 top
R43  8,41 180 top
R47  39,40 180 top
R58  25.5,7 0 bottom
R59  31,21 0 top
U$1  36.88,60 0 bottom
V1  36.5,2 180 bottom
V2  40,62 90 top
V3  42,54 0 top
V4  38,54 0 top
V5  31,62 90 top
V6  41.25,69 270 top
V7  33,54 0 top
V8  38.75,69 270 top
V9  20,62 90 top
V10  32.25,69 270 top
V11  29,54 0 top
V12  10,62 90 top
V13  29.75,69 270 top
V14  22,54 0 top
V15  21.29,68.97 270 top
V16  18.75,69 270 top
V17  18,54 0 top
V18  11.25,69 270 top
V19  8.75,69 270 top
V20  12,54 0 top
V23  8,54 0 top
V26  11,24 180 top
V27  7,24 180 top
V28  4,16 270 top
V29  10,16 270 top
V30  7,10 0 top
V31  24,24 180 top
V32  20,24 180 top
V33  17,16 270 top
V34  23,16 270 top
V35  20,10 0 top
V36  29,9.88 0 top
V37  36,72 0 bottom
V38  13,72 0 bottom
V39  20.43,6.74 0 bottom
X1  34,4.38 0 top
X4  44.88,76.5 180 top
X5  22,76.5 180 top
X6  45,40 90 top
X7  9,3.5 0 top
Y1  3.5,3.5 0 top
Y2  46.5,3.5 0 top
Y3  3.5,70.3 0 top
Y4  46.5,70.3 0 top

### Tracks (layer width: path | path; a pad name or v marks a point on that pad's centre or on a via)
+3V3  (via drill 0.35)
  Top 0.152: H4.A 2.25,39.88 3.12,39 11.38,39 v12.5,37.88
  Top 0.25: 44,28 43.9,27.9
  Top 0.3: v20.37,45.25 21,45.25 21.25,45.5 D1.48 21.07,47 C16.1 | D1.64 v20.37,37.25 21.25,36.37 D1.1 | D1.19 v29.5,38.25 | v29.5,44.75 D1.32 | D1.13 27.25,36.5 27.5,36.75 v28.5,36.75 v28.5,36.74 | 47.4,28.27 47.4,30.9 49.12,32.62 49.12,39.62 48.75,40 X6.B3
  Top 0.4: D2.8 32.91,15.03 33.12,15.25 C49.1 35.88,15.25 36,15.38 36,20.88 38.12,23 47.4,23 | R1.2 41.5,9.25 41.88,8.88 47,8.88 47.65,9.53 47.65,11.25
  Top 0.6: C3.1 47.65,11.25 L1.2 47.65,20.75 C4.1 47.4,23 47.4,28.27 R30.2 44.27,28.27 44,28 | 43.9,27.9 D10.3 41.95,28.95 41.36,28.95 38.12,32.19 v38.12,35.12
  Bottom 0.152: v20.37,37.25 16.79,37.25 16.23,36.69 13.68,36.69 v12.5,37.88
  Bottom 0.3: 20.37,41.25 v20.37,37.25 C22.1 21.25,36.62 21.5,36.38 23.25,36.38 23.62,36.74 v28.5,36.74 C18.1 | 20.37,41.25 20.37,44.99 20.38,45 v20.38,45.24 v20.37,45.25 | v29.5,38.25 29.5,41.38 | 29.5,41.38 v29.5,44.75 C17.1 | C21.1 20.5,41.38 20.37,41.25 | C19.1 29.5,41.38
  Bottom 0.6: v38.12,35.12 35,38.25 v29.5,38.25 C18.1
+12V  (via drill 0.35)
  Top 0.25: V29.1 11.9,20.84 11.75,21 R19.2 | V29.3 9.37,19.36 R33.2 | V12.1 8.1,58.34 7.5,57.75 7.5,57.02 R17.2 | V12.3 10.63,57.14 R15.2 | V9.1 18.09,58.34 17.75,58 17.75,57.02 R13.2 | V9.3 20.64,58.12 20.77,57.98 R9.2 | V5.1 29.09,58.34 28.75,58 28.75,57.02 R7.2 | V5.3 31.64,57.14 R5.2 | V2.1 38.09,58.09 37.77,57.77 R3.2 | V2.3 40.63,58.12 40.77,57.98 R12.2 | V34.3 22.36,20.36 R23.2 | V34.1 24.91,20.82 R21.2
  Top 0.6: C1.1 35.1,12.6 36.75,14.25 36.75,15.5 37.19,15.94 N1.4 38.5,16.14 C2.1 | V12.1 8.1,61.4 8.25,61.55 | V12.3 10.63,61.44 10.75,61.55 | V9.3 20.64,61.44 20.75,61.55 | V9.1 18.09,61.45 18,61.55 | V5.1 29.09,61.45 29,61.55 | V5.3 31.64,61.44 31.75,61.55 | V2.1 38.09,61.45 38,61.55 | V2.3 40.63,61.44 40.75,61.55 | V29.3 9.37,16.76 v9.38,16.75 | V29.1 11.9,16.78 v11.88,16.75 | V34.3 22.36,16.76 v22.38,16.75 | V34.1 24.91,16.78 v24.88,16.75
  Top 1: C1.1 35.1,5.47 X1.1 | 40.75,61.55 38,61.55 C53.1 31.75,61.55 29,61.55 C6.1 20.75,61.55 18,61.55 C8.1 10.75,61.55 8.25,61.55 C10.1 3.55,61.55 2.88,60.88 v2.88,59.25 v2.88,57.88
  Bottom 0.6: v9.38,16.75 9.38,18.45 9.5,18.57 | v11.88,16.75 11.88,18.57 | v22.38,16.75 22.38,18.57 | v24.88,16.75 24.88,18.57
  Bottom 1: X1.1 34,2.45 V1.C
  Bottom 2: X1.1 34,15 30.43,18.57 24.88,18.57 22.38,18.57 C15.1 11.88,18.57 9.5,18.57 C40.1 3.8,18.57 2.88,19.5 v2.88,59.25
ACCLINKRX  (via drill 0.35)
  Top 0.152: D2.1 33.12,18.58 33.12,21.88 34.14,22.89 36,22.89 37.05,23.94 37.05,27.12 37.5,27.57 v37.5,28.5 | D1.17 30.82,36.55 v31.12,36.25
  Bottom 0.152: v31.12,36.25 37.5,29.88 v37.5,28.5
ACCLINKTX  (via drill 0.35)
  Top 0.152: D2.4 29.09,22.34 30.25,23.5 35.75,23.5 36.38,24.12 36.38,29.75 v36.25,29.88 | D1.16 29.95,35.17 v30.5,34.62
  Bottom 0.152: v36.25,29.88 31.5,34.62 v30.5,34.62
ACCLINKTXE  (via drill 0.35)
  Top 0.152: R59.2 33.92,23.2 35.88,23.2 36.68,24 36.68,27.8 36.93,28.06 v36.93,29.25 | D1.15 28.35,35.28 28.35,35.95 28.48,36.08 30.24,36.08 v31,35.32 v31,35.31
  Top 0.25: D2.3 30.36,19.61 30.75,20 31.75,20 | 31.75,20 31.75,20.98 R59.2 | D2.2 31.64,19.89 31.75,20
  Bottom 0.152: v31,35.31 31.6,35.31 36.93,29.98 v36.93,29.25
ACCRTXHI
  Top 0.152: D2.6 30.36,10.62 29.75,10 28.25,10 28.05,9.8 V36.1 28.05,7.55 27.8,7.3 27.12,7.3 26.48,6.66 26.48,5.47 26.25,5.25 25.99,5.25 X7.7
  Bottom 0.25: R58.2 24.24,6.84 X7.7
ACCRTXLO
  Top 0.152: D2.7 31.64,12.38 31.5,12.25 31,12.25 30.67,11.92 30.67,10.42 29.95,9.7 V36.2 29.95,7.7 29.25,7 27.25,7 26.78,6.53 X7.8
  Bottom 0.25: R58.1 26.78,6.86 X7.8
BOOT0
  Top 0.25: D1.60 R31.2
BOOT1
  Top 0.25: D1.28 R32.2
GND  (via drill 0.35)
  Top 0.152: R25.2 16,22.73 | 16,22.73 R26.2 | C24.2 23.98,31.25 R41.2 R40.2 | C25.2 30.6,32.75 R39.1 | C14.2 35.6,32.75 R28.1 | 16,22.25 16,22.5 16,22.73 | 3,21.88 3,22 3,22.6 3.12,22.73
  Top 0.25: R37.2 3.12,22.73 R38.2 | V26.2 10.05,26.77 R20.2 | V27.2 6.05,26.77 R34.2 | V31.2 23.27,25.32 R22.2 | V32.2 19.27,25.32 R24.2 | R18.2 8.72,52.67 V23.2 | R16.2 12.72,52.67 V20.2 | R14.2 18.73,52.67 V17.2 | R10.2 22.73,52.67 V14.2 | R8.2 29.73,52.67 V11.2 | R6.2 33.73,52.67 V7.2 | R11.2 42.73,52.67 V3.2 | R4.2 38.73,52.67 V4.2 | R2.1 37.92,10.28 37.9,10.25
  Top 0.3: D1.47 21.72,46.85 21.72,47.62 21.47,47.88 18.75,47.88 18.5,47.62 C16.2 v17.38,47 | D1.63 19.98,37.75 20.11,37.88 20.13,37.88 20.62,38.38 v22.75,38.38 | v27,43.75 29.5,43.75 30,44.25 D1.31 31.75,44.25 31.88,44.38 31.88,46.75 32.2,47.08 C20.2 34.42,47.08 34.62,46.88 v34.62,46 | D1.18 30.8,37.72 30.02,37.72 29.68,37.38 v27,37.38 26.75,37.12 D1.12 | X6.B5 48.96,42.54 v49,42.5 | R4.2 38.75,50.98 v38.75,49.75 | R11.2 42.75,50.98 v42.75,49.75 | R8.2 29.75,50.98 v29.75,49.75 | R6.2 33.73,49.65 v33.75,49.62 | R32.1 35.88,42.77 v35.88,44.12 | R18.2 8.72,49.9 v8.75,49.88 | R16.2 12.72,50.02 v12.75,50 | R35.1 v10.12,44 | R43.1 v10.12,41 | R36.1 v10.12,38 | R31.1 12.53,40.35 v12.5,40.38 | v22.25,30 C24.2 C23.2 | R34.2 6.28,28.35 v6.25,28.38 | R20.2 10.25,27.02 v10.25,28.32 | R24.2 19.27,28.02 v19.62,28.38 | R22.2 v22,27 | R59.1 30.27,22.15 v30.62,22.5 | v29.12,15.62 29.12,13.67 D2.5 29.09,11.07 V36.3 | D10.2 42.12,30.18 v42.12,31.5 | R28.1 v35.62,34 | R39.1 30.65,32.75 v32,32.75 | C49.2 v35,17.88
  Top 0.4: V23.2 8.95,53.7 9.25,54 13,54 | 13,54 19,54 | 19,54 23,54 | 23,54 30,54 | 30,54 34,54 | 34,54 39,54 | 39,54 43,54 | 43,54 v44,54 | V3.2 43,52.95 43,54 | V4.2 39,52.95 39,54 | V7.2 34,52.95 34,54 | V11.2 30,52.95 30,54 | V14.2 22.95,53.95 23,54 | V17.2 18.95,53.95 19,54 | V20.2 12.95,53.95 13,54
  Top 0.5: V33.3 16.36,20.39 16,20.76 16,22.25 | 16,22.5 v16,23.88 | V28.3 3.37,20.39 3,20.76 3,21.88 | 3,22 3,24.25 3.12,24.38 v4.38,24.38
  Top 0.6: 40.25,15 N1.2 42.25,15 42.5,14.75 42.5,12.75 42.75,12.5 | 40.25,15 40,15.25 C2.2 | C1.2 37.9,12.85 37.5,13.25 37.5,13.94 37.5,14.75 37.75,15 40.25,15 | 44.6,12.4 C3.2 | 42.5,19.25 42.75,19.5 | 44.6,19.6 C4.2 | V33.3 16.36,16.76 v16.38,16.75 | V33.1 18.88,18.33 v18.88,16.75 | V28.3 3.37,16.76 v3.38,16.75 | V28.1 5.91,16.78 v5.88,16.75
  Top 1: C10.2 6.82,63.45 7.54,62.72 12.46,62.72 13.19,63.45 C8.2 16.82,63.45 17.55,62.72 22.45,62.72 23.18,63.45 C6.2 27.82,63.45 28.55,62.72 33.45,62.72 34.19,63.45 C53.2 36.5,63.45 37.23,62.72 42.45,62.72 42.48,62.75 | C10.2 v6,65 | C10.2 4.3,63.45 v4.25,63.5 | 42.48,62.75 v43.88,62.75 | 42.48,62.75 43.48,63.75 v43.88,63.75 | v28.12,16.62 v28.12,20.5
  Top 2: v29.88,4.38 v29.88,3 | v29.88,1.5 v29.88,5.5
  Bottom 0.3: v22.75,38.38 C22.2 | v27,43.75 C17.2 | v27,37.38 C18.2 | v49,42.5 48.88,42.5 | v10.25,28.32 10.25,28.38
  Bottom 0.4: V39.2 V39.5
  Bottom 0.6: V37.5 36,72 | 36,72 V37.2 | X4.4 37.26,75.75 36,74.5 36,72 | V38.5 13,72 | 13,72 V38.2 | 13,72 13,74.5 14.38,75.88 X5.4
  Bottom 1: v29.12,15.62 28.38,16.38 28.12,16.38 v28.12,16.62
  Bottom 2: v29.88,3 v29.88,1.5 | v29.88,5.5 v29.88,4.38
  other vias: 1,31 6.12,31 12.5,35.75 5.38,36.38 5.25,45.5 1,45.5 14.75,27.25 32.25,29 38.75,24.88 38.75,21.12 13.88,9.62 46.25,32.5 47.75,51.5 47.75,59.5 35.62,66.88 25.5,67 15,67 14.75,58.75 25.38,58.88 35.62,58.75 25.62,52.38 15,52.38 35.5,52.25 22.75,42.38 27,39.88 22.88,39.88 17.38,42 17.25,36.12 39.38,35.75 34,40.12 30.75,45.88 13.5,16.12 48.75,30.38
  pour Bottom: 0,0 50,0 50,80 0,80
  pour Top: 0,0 arc1 50,0 50,80 0,80
INPUT1
  Top 0.25: X7.5 19.85,3.5 26.75,10.4 26.75,24.5 27.83,25.58 R29.1
  Bottom 0.6: V39.4 19.16,5.77 X7.5
INPUT2
  Top 0.25: X7.6 21.7,4.78 27.15,10.23 27.15,23.15 28,24 30.88,24 32.45,25.58 R27.1
  Bottom 0.6: X7.6 21.7,5.77 V39.3
INPUT_1
  Top 0.152: C25.1 29.62,31.25 | 29.62,31.25 30.6,31.25 R39.2 32.4,31.27 32.62,31.5 32.62,41.12 32,41.75 D1.26 | R29.2 29.62,31.25
INPUT_2
  Top 0.152: 34.62,31.25 C14.1 33.12,31.25 32.93,31.45 32.93,41.45 32.12,42.25 D1.27 | 34.62,31.25 35.6,31.25 R28.2 | R27.2 34.62,31.25
JUMP1
  Top 0.152: D1.8 24.75,33 24.48,32.73 R41.1
JUMP2
  Top 0.152: D1.9 25.25,33.88 25.5,33.62 R40.1
LED_GRN
  Top 0.25: D1.59 19.12,39.8 16.63,39.8 14.08,42.35 1.6,42.35 1.25,42 1.25,38.25 1.5,38 H3.A
LED_RED
  Top 0.25: H2.A 2.25,43 2.5,42.75 14.25,42.75 16.75,40.25 D1.58
MOTOR1_H1  (via drill 0.35)
  Top 0.152: R20.1 11.72,32.98 v16,37.25 | v16,43.75 D1.51
  Top 0.25: V26.1 11.95,26.77 R20.1
  Bottom 0.152: v16,37.25 v16,43.75
MOTOR1_H2  (via drill 0.35)
  Top 0.152: R34.1 7.88,27.15 7.88,28 8.75,28.88 10.38,28.88 11.29,29.8 11.29,33.05 15,36.75 v15,37.25 | v15,43.75 15.21,43.75 15.77,43.19 16.23,43.19 16.29,43.25 D1.52
  Top 0.25: V27.1 7.95,26.77 R34.1
  Bottom 0.152: v15,37.25 v15,43.75
MOTOR1_L1
  Top 0.152: R37.1 1.12,22.15 1.12,23.62 4.7,27.2 4.7,33.38 8.25,36.93 13.37,36.93 15,38.55 17.93,38.55 18.12,38.75 D1.61
  Top 0.25: V28.4 2.1,21.18 R37.1
MOTOR1_L2
  Top 0.152: R38.1 5,22.27 5,33.25 8.38,36.62 13.5,36.62 15.12,38.25 D1.62
  Top 0.25: V28.2 4.63,19.36 4,20 R38.1
MOTOR1A
  Top 0.3: 3.49,15.37 3.49,15.38 3.37,15.5
  Top 0.6: 11.5,10.25 11.9,10.65 V29.8 11.9,15.38 | 10.5,10.25 10.63,10.38 V29.7 10.63,15.5 | V28.5 2.1,15.37 | V28.6 3.37,15.5
  Top 1: X7.2 11.54,7.51 V30.A 9.3,10.25 10.5,10.25 11.5,10.25 | 2.1,15.37 3.49,15.37 | 3.37,15.5 10.63,15.5 10.75,15.38 11.9,15.38
  Bottom 0.25: C12.1 11,4.04 X7.2
MOTOR1B
  Top 0.6: V29.6 9.37,12.12 9.25,12 | V29.5 8.1,12.1 8,12 | V28.7 4.63,12 | V28.8 5.91,12.15 5.75,12
  Top 1: X7.1 9,5.95 V30.C 4.95,11.69 4.63,12 5.75,12 8,12 9.25,12
  Bottom 0.25: C12.2 9.5,4 X7.1
MOTOR2_H1
  Top 0.152: D1.25 32,41.25 32.25,41 32.25,34.5 31.25,33.5 27.75,33.5 27.38,33.12 27.38,27.88 26.5,27 R22.1
  Top 0.25: V31.1 24.73,25.32 R22.1
MOTOR2_H2
  Top 0.152: D1.24 31.75,40.75 31.95,40.55 31.95,34.63 31.12,33.8 27.62,33.8 27.07,33.25 27.07,28.38 26.82,28.12 21,28.12 20.74,27.86 20.74,26.99
  Top 0.25: V32.1 20.95,26.77 20.74,26.99 R24.1
MOTOR2_L1
  Top 0.152: R25.1 14.12,22.15 14.12,23.25 15.5,24.62 16.62,24.62 17.57,25.57 17.57,27.75 19.12,29.3 25.68,29.3 26.25,29.88 26.25,33.5 25.75,34 D1.10
  Top 0.25: V33.4 15.1,21.18 R25.1
MOTOR2_L2
  Top 0.152: R26.1 17.88,22.15 17.88,27.62 19.25,29 25.81,29 26.55,29.75 26.55,33.63 26.25,33.93 D1.11
  Top 0.25: V33.2 17.64,19.61 17,20.25 R26.1
MOTOR2A
  Top 0.3: 16.36,15.5 16.36,15.37
  Top 0.6: V33.5 15.1,15.35 15.12,15.37 | 24.91,15.38 V34.8 24.91,10.4 24.75,10.25 | V33.6 16.36,15.37 | 23.64,15.5 V34.7 23.64,10.37 23.75,10.25
  Top 1: X7.4 16.62,4.57 V35.A 22.3,10.25 23.75,10.25 24.75,10.25 | 15.12,15.37 16.36,15.37 | 16.36,15.5 23.64,15.5 23.75,15.38 24.91,15.38
  Bottom 0.25: C13.1 16,4.12 X7.4
MOTOR2B
  Top 0.6: V33.7 17.64,12.12 17.75,12 | 22.25,12 22.36,12.12 V34.6 | V34.5 21.09,12.15 21.25,12 | V33.8 18.91,12.1 19,12
  Top 1: X7.3 14.08,6.13 V35.C 17.95,11.8 17.75,12 19,12 21.25,12 22.25,12
  Bottom 0.25: C13.2 14.5,3.92 X7.3
N$1
  Top 0.6: N1.3 41.3,16.19 | L1.1 44.16,16.19
  Top 1: 44.16,16.19 41.3,16.19
N$2
  Top 0.25: V2.2 39.37,58.12 39.23,57.98 R3.1 39.23,55.73 38.6,55.1 V4.3
N$3
  Top 0.25: R1.1 R2.2 40,12.5 39.75,12.75 39,12.75 38.75,13 38.75,14.02 N1.5
N$4
  Top 0.25: V5.4 32.91,58.34 33.25,58 33.25,57.02 R5.1 33.23,55.33 V7.3
N$5
  Top 0.25: V5.2 30.36,57.14 R7.1 30.23,55.48 29.85,55.1 V11.3
N$6
  Top 0.25: V9.4 21.91,58.34 22.25,58 22.25,57.02 R9.1 22.23,55.33 V14.3
N$7
  Top 0.25: V9.2 19.36,58.12 19.23,57.98 R13.1 19.25,57.02 19.25,55.25 19.1,55.1 V17.3
N$8
  Top 0.25: V12.4 11.9,57.32 R15.1 12.22,55.33 V20.3
N$9
  Top 0.25: V12.2 9.37,58.37 9,58 9,57.02 R17.1 8.97,56.08 V23.3
N$10
  Top 0.25: V29.2 10.63,19.61 10.25,20 9.5,20 9.28,20.23 9.28,20.75 R19.1 9.28,22.02 10,22.75 10.85,22.75 V26.3
N$11
  Top 0.25: V2.4 41.91,58.34 42.23,58.02 R12.1 42.23,55.33 V3.3
N$12
  Top 0.25: V29.4 8.1,19.91 8,20 6.5,20 6.25,20.25 6.25,20.75 6.25,20.98 | 6.25,20.98 R33.1 | V27.3 6.25,22.15 6.25,20.98
N$15
  Top 0.25: V34.2 23.64,19.61 23.25,20 23.25,20.98 R21.1 23.27,22.18 V31.3
N$16
  Top 0.25: V34.4 21.09,19.66 20.75,20 20.5,20 20.27,20.23 R23.1 20.27,22.62 V32.3
N$19
  Top 0.25: H3.C R36.2
N$20
  Top 0.25: H2.C R35.2
N$21
  Top 0.25: H4.C R43.2
NERT
  Top 0.6: V2.6 40.63,66.33 V6.A 41.91,66.3 V2.5
NERT1
  Top 0.6: V2.8 38.09,66.3 V8.A 39.37,66.33 V2.7
NERT2
  Top 0.6: V5.6 31.64,66.33 V10.A 32.91,66.3 V5.5
NERT3
  Top 0.6: V5.8 29.09,66.3 V13.A 30.36,66.33 V5.7
NERT4
  Top 0.6: V9.6 20.64,66.27 V15.A 21.91,66.3 V9.5
NERT5
  Top 0.6: V9.8 18.09,66.3 V16.A 19.36,66.33 V9.7
NERT6
  Top 0.6: V12.6 10.63,66.33 V18.A 11.9,66.3 V12.5
NERT7
  Top 0.6: V12.8 8.1,66.3 V19.A 9.37,66.33 V12.7
OSCIN
  Top 0.152: G1.1 16.75,33.85 16.75,33 17,32.75 C23.1 21.38,32.75 21.62,33 21.62,33.24 21.88,33.5 22.57,33.5 23.25,34.18 D1.5
OSCOUT
  Top 0.152: G1.3 19.75,31.5 20.13,31.88 21.38,31.88 C24.1 23.75,34.25 D1.6
OUT1
  Top 1: V6.C 41.25,73.25 42.25,74.25 44.5,74.25 44.88,74.62 X4.1
  Bottom 0.6: V37.3 39.05,71.05 42.25,74.25 44.5,74.25 44.88,74.62 X4.1
OUT2
  Top 1: V8.C 38.75,73.75 39.8,74.8 X4.3
  Bottom 0.6: V37.1 37.3,73 39,73 39.8,73.8 X4.3
OUT3
  Top 1: V10.C 32.25,73 33,73.75 34.25,73.75 34.72,74.22 X4.5
  Bottom 0.6: X4.5 34.72,72.98 V37.6
OUT4
  Top 1: X4.7 29.64,71.17 V13.C
  Bottom 0.6: V37.4 32.95,71.05 31.75,72.25 31.75,73.5 31.25,74 30,74 29.64,74.36 X4.7
OUT5
  Top 1: V15.C 21.29,72.53 22,73.25 X5.1
  Bottom 0.6: V38.3 15.8,71.05 18.75,74 21.5,74 22,74.5 X5.1
OUT6
  Top 1: V16.C 18.75,72.75 16.92,74.58 X5.3
  Bottom 0.6: V38.1 15.2,72.95 16.92,74.67 X5.3
OUT7
  Top 1: V18.C 11.25,73 11.84,73.59 X5.5
  Bottom 0.6: V38.6 11.84,73.04 X5.5
OUT8
  Top 1: V19.C 8.75,73.25 8,74 7.25,74 6.76,74.49 X5.7
  Bottom 0.6: V38.4 9.7,71.05 9,71.75 9,73.5 8.5,74 7.25,74 6.76,74.49 X5.7
OUT_1
  Top 0.25: V3.1 41.27,52.67 R11.1 41.27,48.02 40.5,47.25 37,47.25 33,43.25 D1.29
OUT_2
  Top 0.25: V4.1 37.27,52.67 R4.1 37.27,48.77 36.75,48.25 29,48.25 28.75,48 D1.33
OUT_3
  Top 0.25: V7.1 32.27,52.67 R6.1 32.27,49.02 32,48.75 28.75,48.75 28.25,48.25 D1.34
OUT_4
  Top 0.25: V11.1 28.27,52.67 R8.1 28.27,49.27 27.75,48.75 D1.35
OUT_5
  Top 0.25: V14.1 21.27,52.67 R10.1 21.27,50.23 21.5,50 27,50 27.25,49.75 D1.36
OUT_6
  Top 0.25: V17.1 17.27,52.67 R14.1 17.27,50.23 17.9,49.6 24.25,49.6 24.75,49.1 D1.41
OUT_7
  Top 0.25: V20.1 11.28,52.67 R16.1 11.28,49.98 12.05,49.2 23.75,49.2 24.25,48.7 D1.42
OUT_8
  Top 0.25: V23.1 7.28,52.67 R18.1 7.28,49.98 8.46,48.79 23.46,48.79 23.75,48.5 D1.43
RESETL  (via drill 0.35)
  Top 0.152: D10.1 44,30.1 | 44,30.1 44.65,30.1 45.02,29.73 R30.1 | 41.5,37.46 41.21,37.46 40.5,36.75 | 40.5,36.75 40.5,33.5 41.38,32.62 43.75,32.62 44,32.38 44,30.1 | D1.7 24.25,33.96 v24.08,33.79 | v33.62,36.75 40.5,36.75
  Top 0.25: X6.A1 41.5,37.46
  Bottom 0.152: v33.62,36.75 31.41,36.75 31.36,36.81 30.89,36.81 30.28,36.19 26.48,36.19 v24.08,33.79
SWCLK
  Top 0.3: X6.A3 R47.1
SWCLK_CPU  (via drill 0.35)
  Top 0.25: R47.2 38.27,44.1 v38.25,44.12 | v19.25,45.88 19.18,45.8 D1.49
  Bottom 0.25: v38.25,44.12 37.38,45 37.38,46.12 36.18,47.32 26.93,47.32 24.5,44.9 24,44.9 23.64,45.25 23.64,45.48 23.25,45.88 v19.25,45.88
SWDIO
  Top 0.3: X6.A2 41.35,38.73 40.62,38 R42.1
SWDIO_CPU  (via drill 0.35)
  Top 0.25: v37.62,43.38 37.62,40.69 37.52,40.59 37.52,38.75 R42.2 | v24.25,44.25 23.4,45.1 22.83,45.1 22.25,45.68 D1.46
  Bottom 0.25: v37.62,43.38 37.62,44.18 36.97,44.83 36.97,45.7 35.75,46.92 32.88,46.92 27.09,46.92 24.67,44.49 24.49,44.49 v24.25,44.25
USART6RX  (via drill 0.35)
  Top 0.25: v38.62,45.38 39.25,45.38 39.38,45.25 39.38,42.12 40.23,41.27 X6.A4 | D1.45 22.75,45.75 23,45.5 v24.25,45.5
  Bottom 0.25: v24.25,45.5 24.25,47 24.97,47.72 36.65,47.72 37.88,46.5 37.88,45.62 38.12,45.38 v38.62,45.38
USART6TX  (via drill 0.35)
  Top 0.25: v38.62,46.38 39.38,46.38 39.88,45.88 39.88,43 40.38,42.5 42.2,42.5 arc90 X6.A5 | v22.75,48.12 23,48.12 23.25,47.88 D1.44
  Bottom 0.25: v38.62,46.38 36.88,48.12 v22.75,48.12
VCAP1
  Top 0.3: D1.30 32.62,43.75 33,44.12 C20.1

### Text on the board
tPlace: - | +
bPlace: TELAKONE AUX IO | (C) 2018 KIMMOLI
DrillLegend: LAYER-STACK
DrillLegend_01-16: 01-16
DrillLegend_01-20: 01-20